# EAGLE design RF_front_end_final_copy_for_doc (EAGLE 5.10)

## Sheet 1 of 9
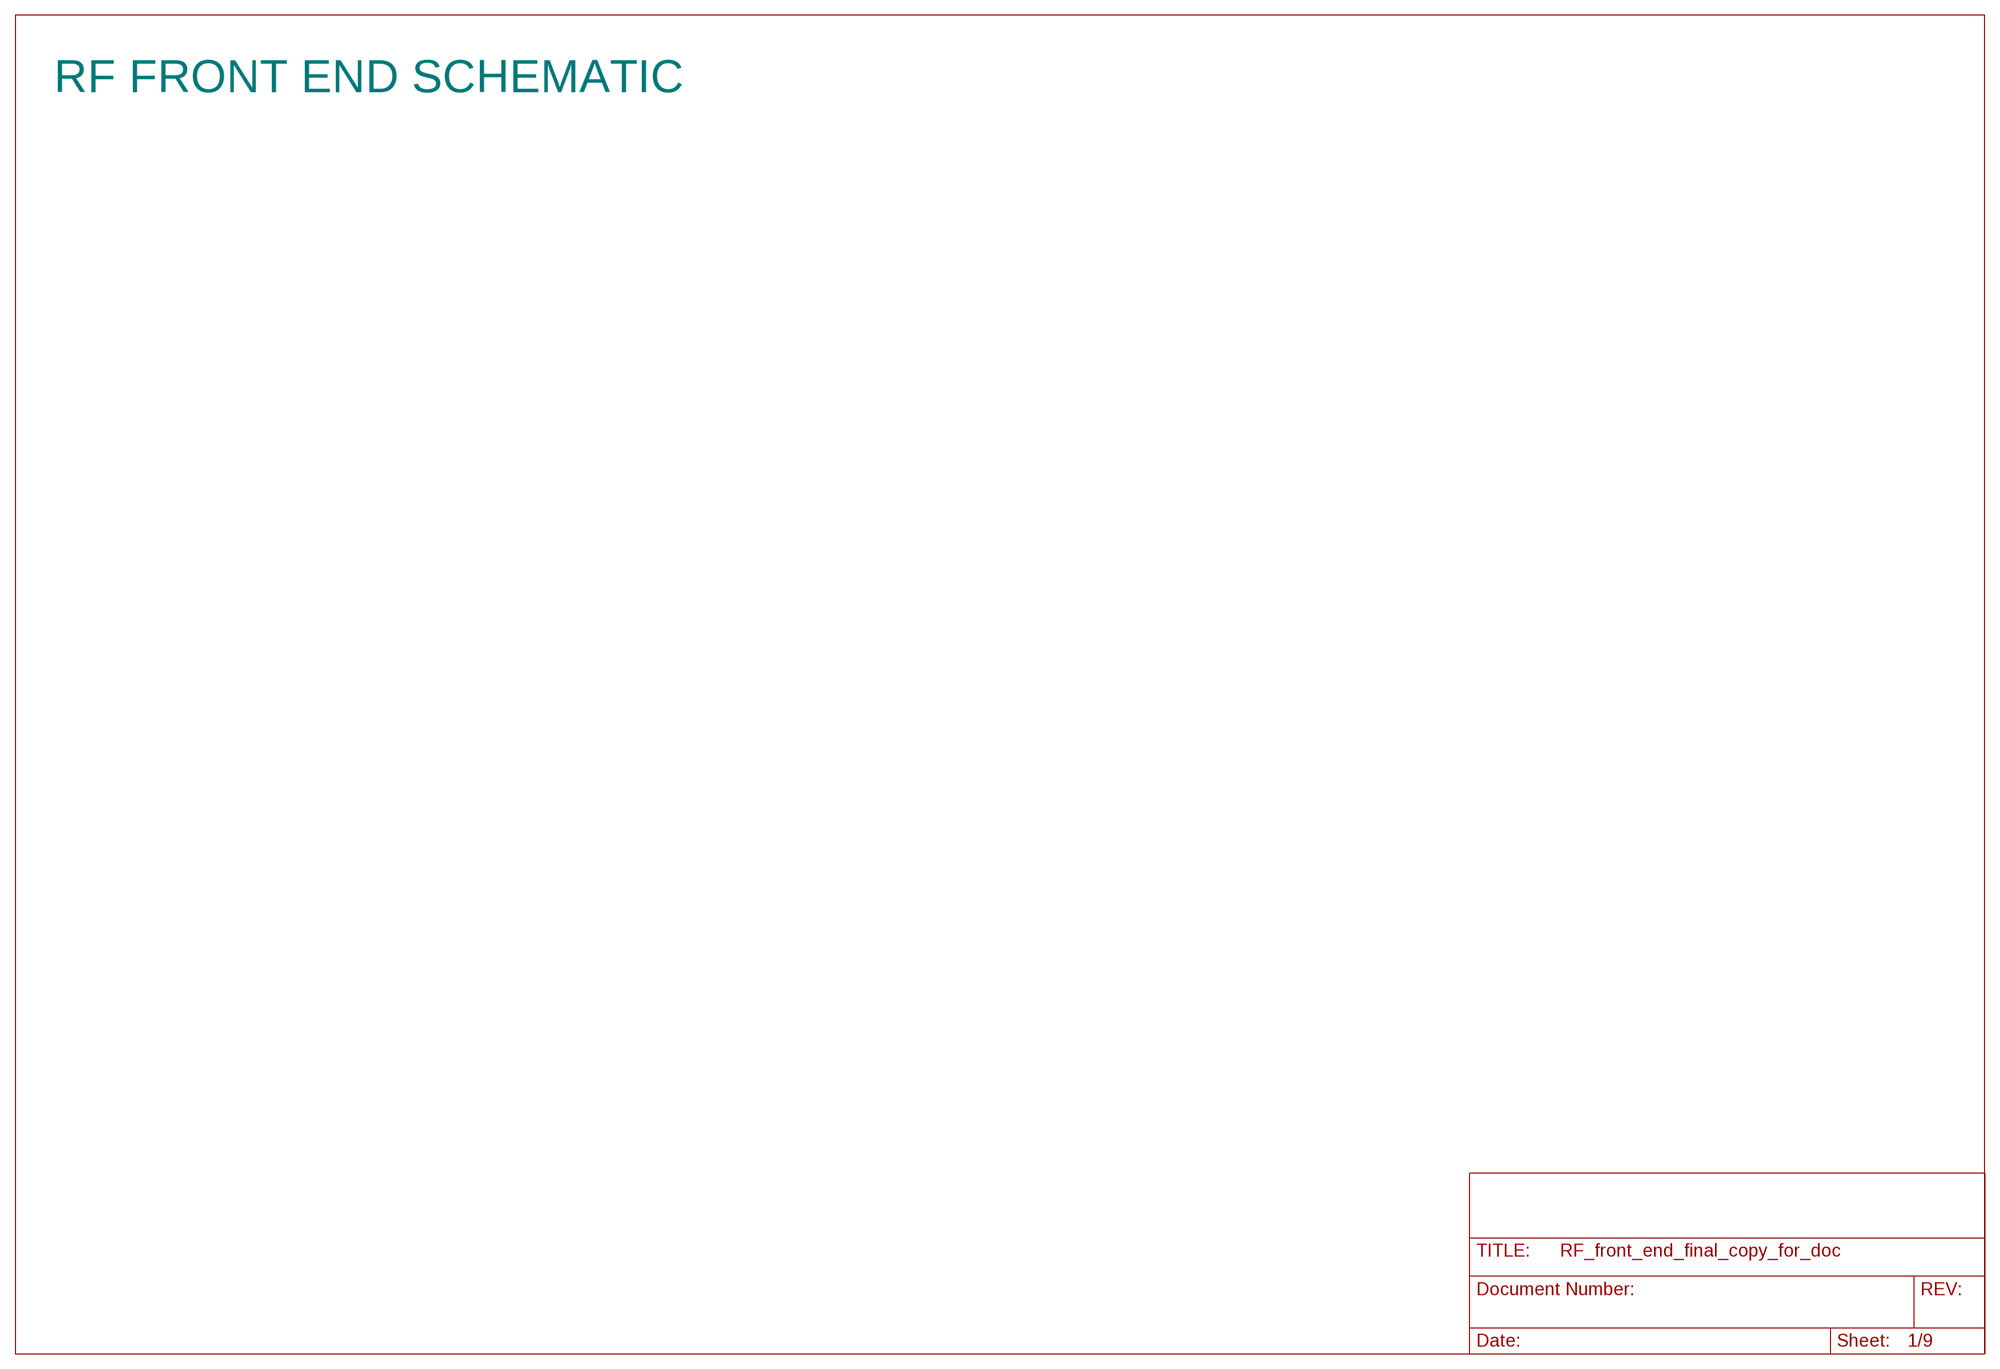
[diagram p0: schematic, sheet 1]

### Notes on the sheet
- RF FRONT END SCHEMATIC

## Sheet 2 of 9
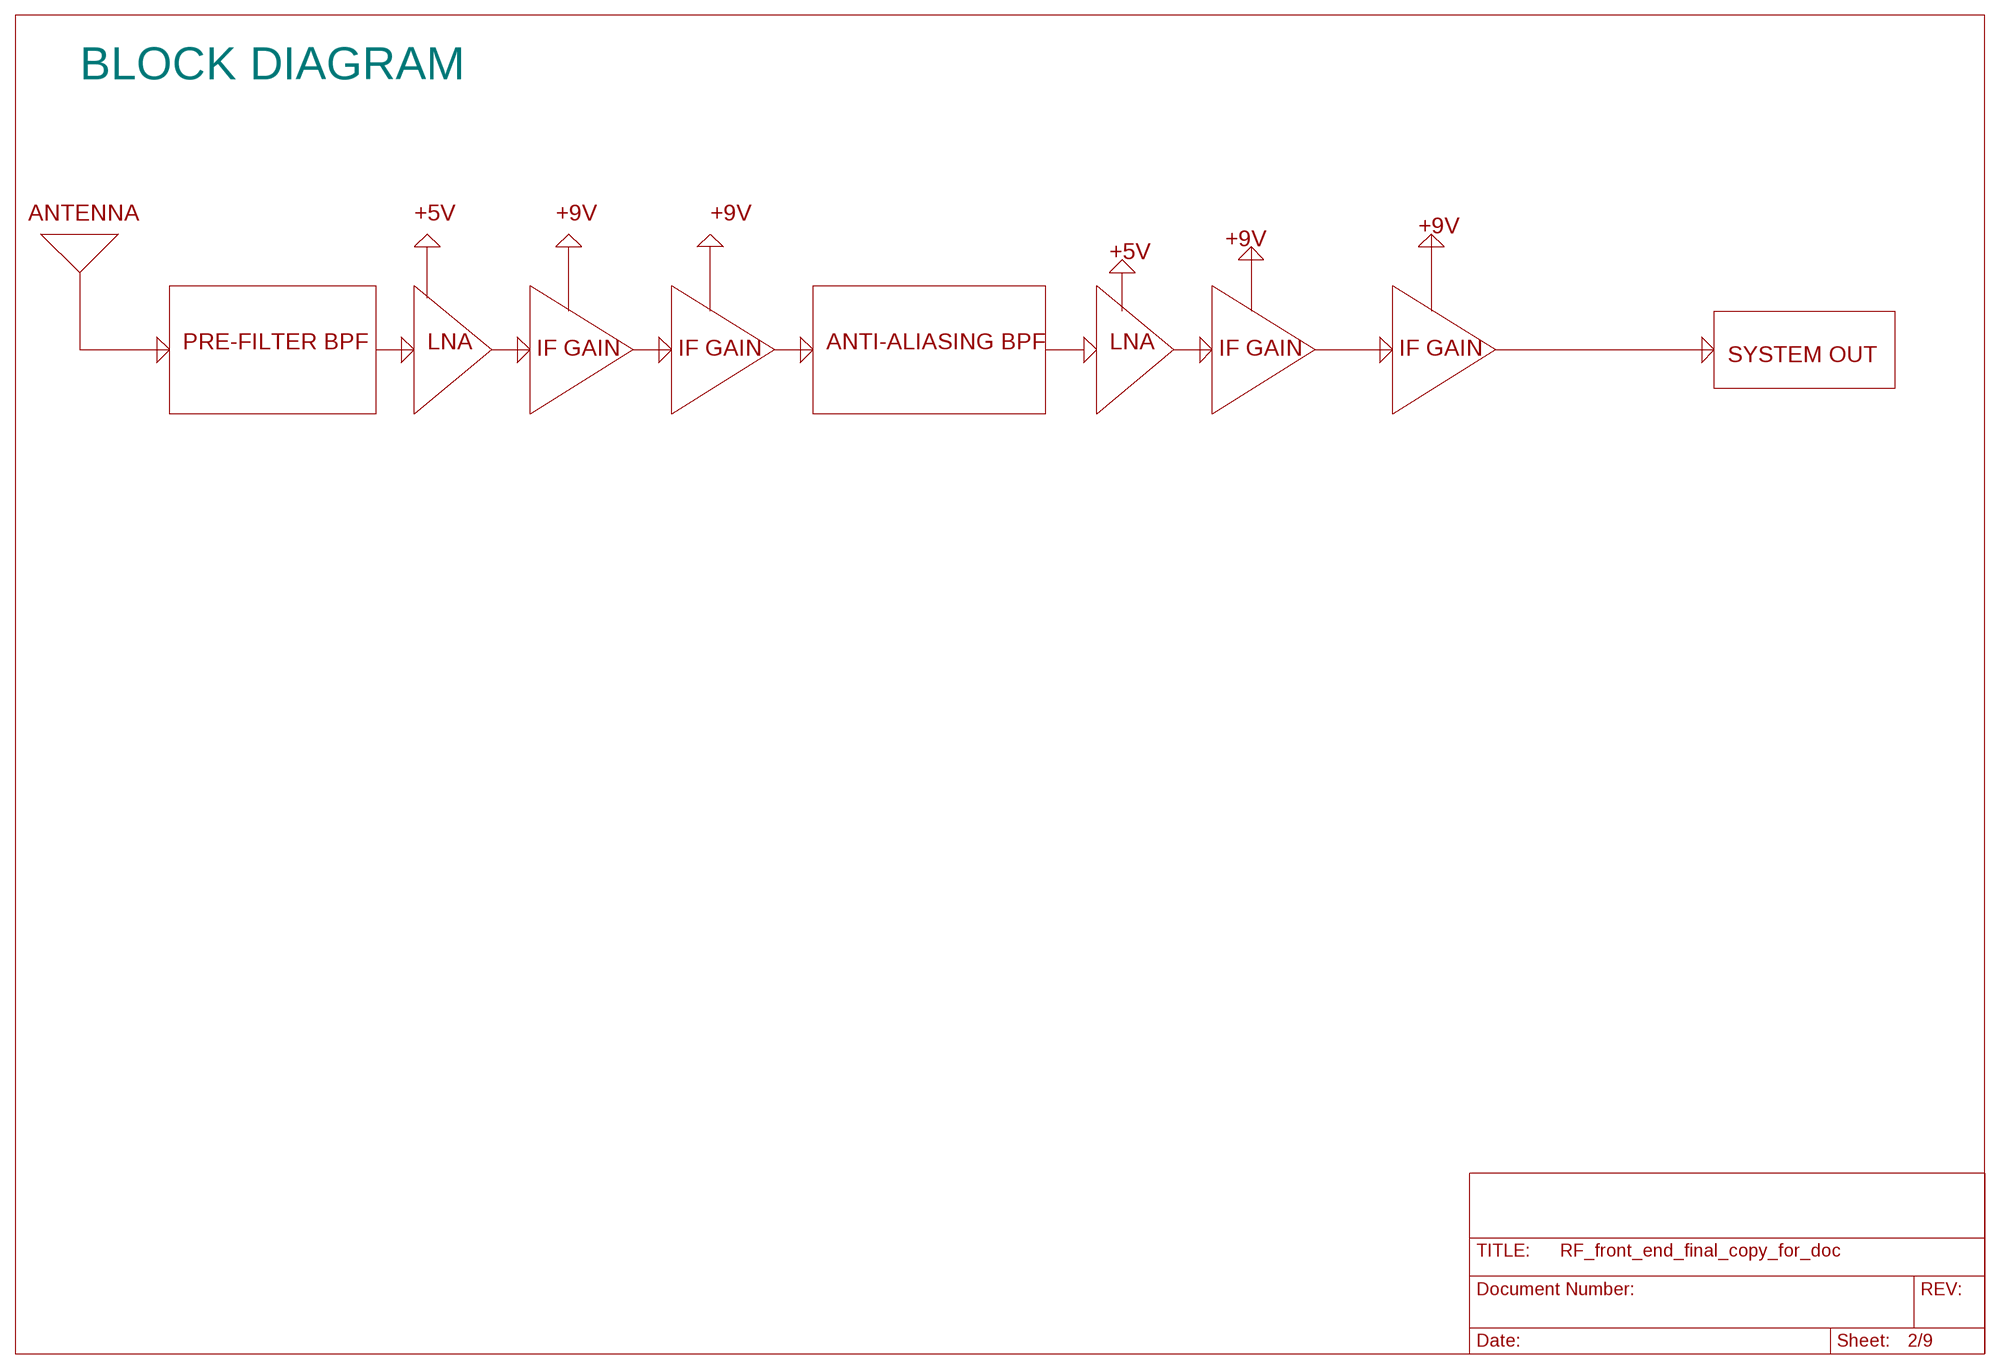
[diagram p1: schematic, sheet 2]

### Notes on the sheet
- BLOCK DIAGRAM
- ANTENNA | +5V | +9V | +9V
- +9V
- +9V
- +5V
- PRE-FILTER BPF | LNA | IF GAIN | IF GAIN | ANTI-ALIASING BPF | LNA | IF GAIN | IF GAIN
- SYSTEM OUT

## Sheet 3 of 9
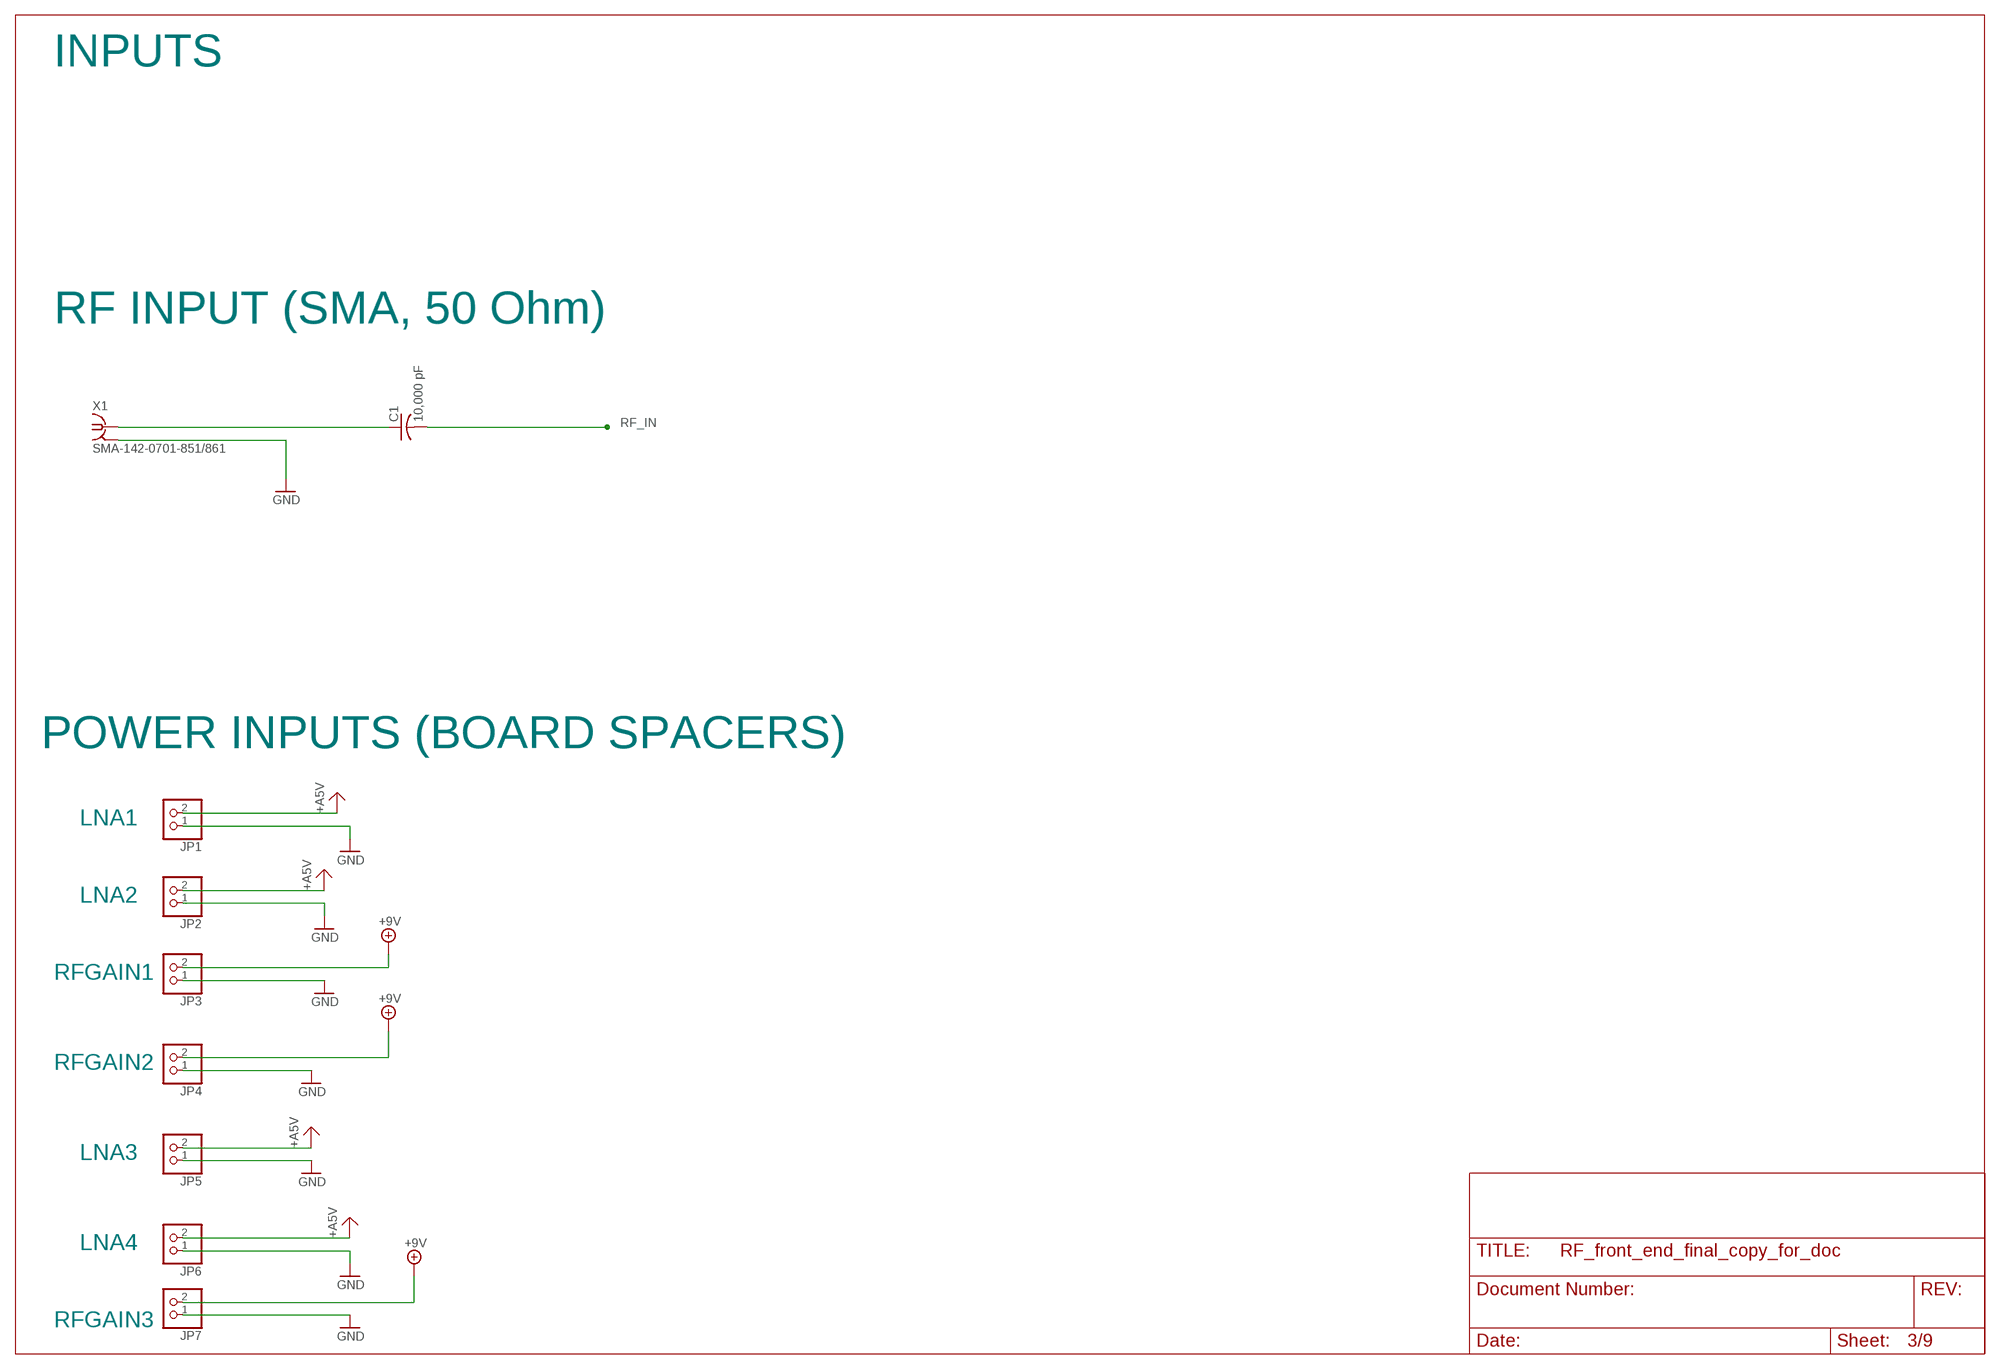
[diagram p2: schematic, sheet 3]

### Parts
C1  10,000 pF  C-USC0603  [C0603]
JP1  PINHD-1X2  [1X02]
JP2  PINHD-1X2  [1X02]
JP3  PINHD-1X2  [1X02]
JP4  PINHD-1X2  [1X02]
JP5  PINHD-1X2  [1X02]
JP6  PINHD-1X2  [1X02]
JP7  PINHD-1X2  [1X02]
X1  SMA-142-0701-851/861  [J502-ND-142-0701-851/861]

### Nets
+9V: JP3.2 JP4.2 JP7.2 ; also sheet 6,8
+A5V: JP1.2 JP2.2 JP5.2 JP6.2 ; also sheet 5,8
GND: JP1.1 JP2.1 JP3.1 JP4.1 JP5.1 JP6.1 JP7.1 X1.G@1(GND) ; also sheet 4,5,6,7,8,9
N$16: C1.1 X1.1
RF_IN: C1.2 ; also sheet 4

### Notes on the sheet
- INPUTS
- RF INPUT (SMA, 50 Ohm)
- POWER INPUTS (BOARD SPACERS)
- LNA1
- LNA2
- RFGAIN1
- RFGAIN2
- LNA3
- LNA4
- RFGAIN3

## Sheet 4 of 9
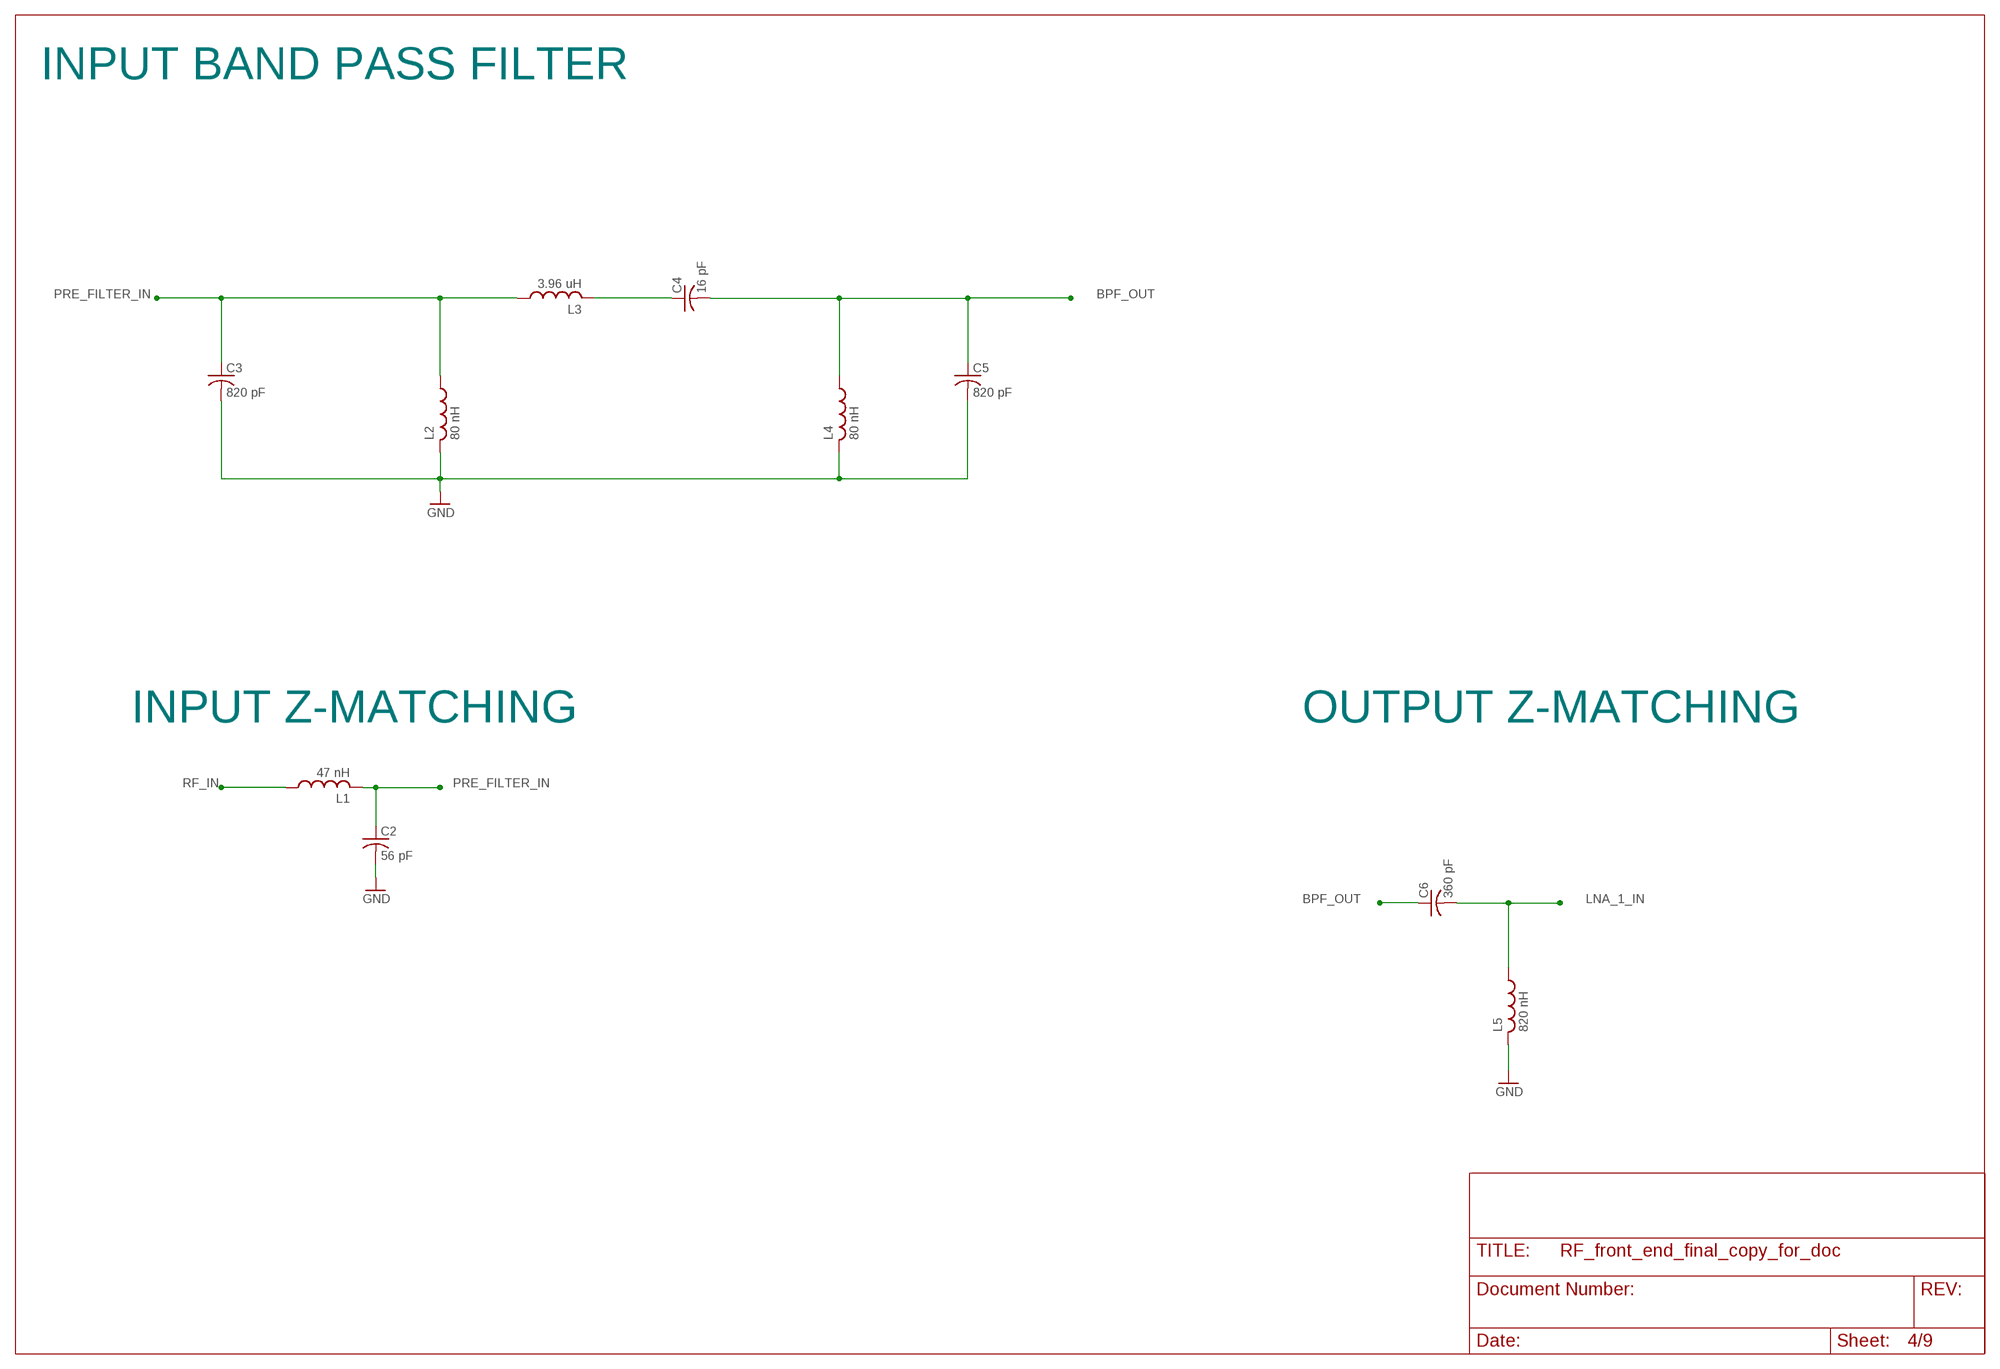
[diagram p3: schematic, sheet 4]

### Parts
C2  56 pF  C-USC0603  [C0603]
C3  820 pF  C-USC0805  [C0805]
C4  16 pF  C-USC0603  [C0603]
C5  820 pF  C-USC0805  [C0805]
C6  360 pF  C-USC0603  [C0603]
L1  47 nH  L-US0603  [R0603]
L2  80 nH  L-US0805  [R0805]
L3  3.96 uH  L-US1812  [C1812]
L4  80 nH  L-US0805  [R0805]
L5  820 nH  L-US0603  [R0603]

### Nets
BPF_OUT: C4.2 C5.1 C6.1 L4.1
GND: C2.2 C3.2 C5.2 L2.2 L4.2 L5.2 ; also sheet 3,5,6,7,8,9
LNA_1_IN: C6.2 L5.1 ; also sheet 5
N$71: C4.1 L3.2
PRE_FILTER_IN: C2.1 C3.1 L1.2 L2.1 L3.1
RF_IN: L1.1 ; also sheet 3

### Notes on the sheet
- INPUT BAND PASS FILTER
- INPUT Z-MATCHING | OUTPUT Z-MATCHING

## Sheet 5 of 9
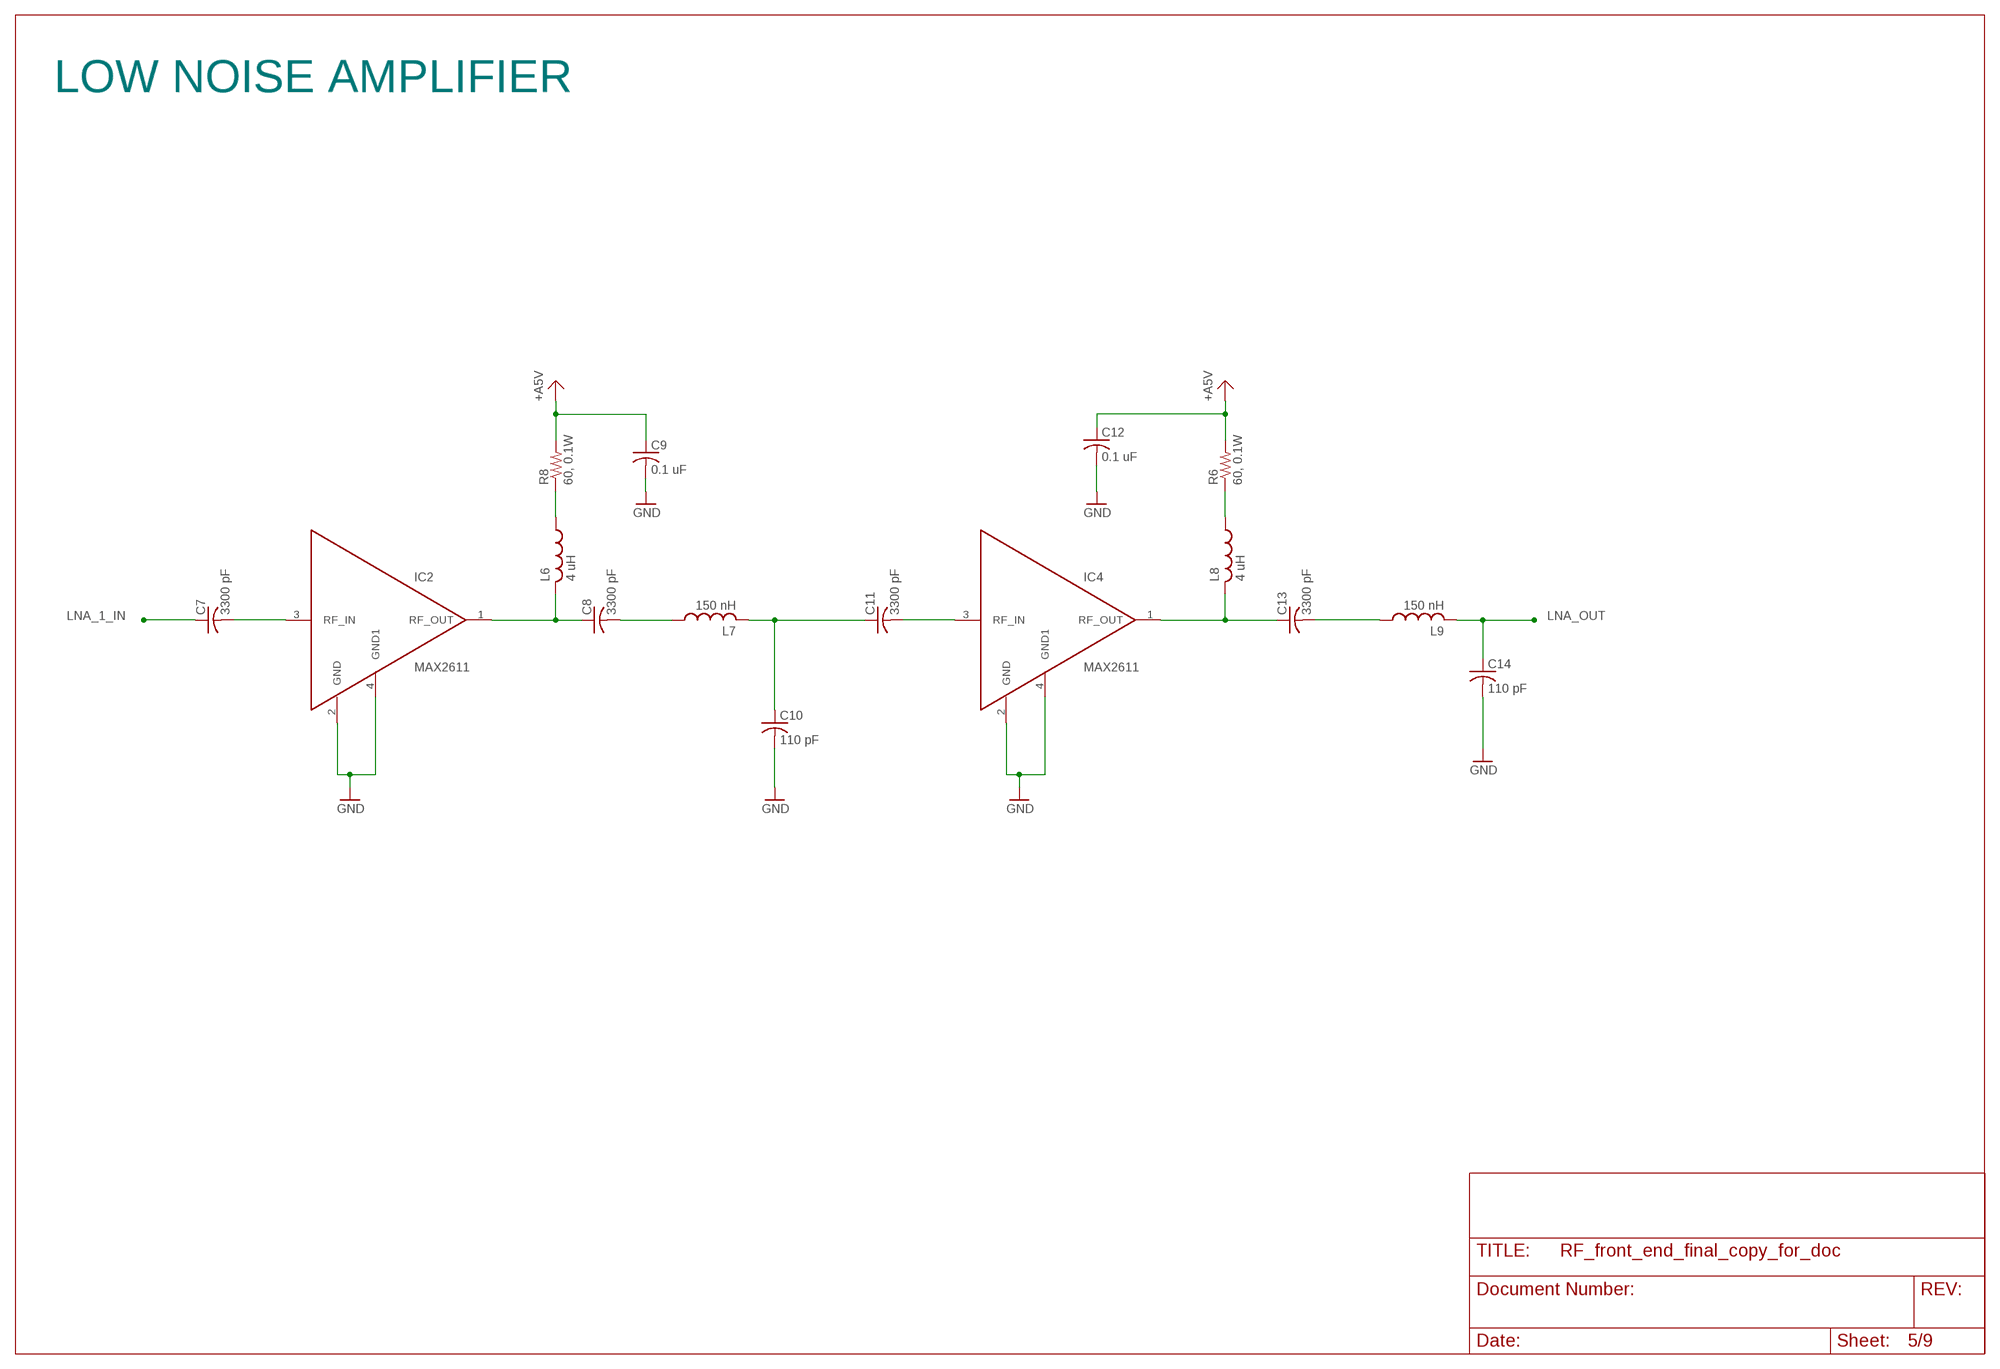
[diagram p4: schematic, sheet 5]

### Parts
C7  3300 pF  C-USC0603  [C0603]
C8  3300 pF  C-USC0603  [C0603]
C9  0.1 uF  C-USC0603  [C0603]
C10  110 pF  C-USC0603  [C0603]
C11  3300 pF  C-USC0603  [C0603]
C12  0.1 uF  C-USC0603  [C0603]
C13  3300 pF  C-USC0603  [C0603]
C14  110 pF  C-USC0603  [C0603]
IC2  MAX2611  [SOT143_MAX2611]
IC4  MAX2611  [SOT143_MAX2611]
L6  4 uH  L-US1008LS-392XJLB  [1008LS-392XJLB]
L7  150 nH  L-US0603  [R0603]
L8  4 uH  L-US1008LS-392XJLB  [1008LS-392XJLB]
L9  150 nH  L-US0603  [R0603]
R6  60, 0.1W  R-US_R0603  [R0603]
R8  60, 0.1W  R-US_R0603  [R0603]

### Nets
+A5V: C9.1 C12.1 R6.2 R8.2 ; also sheet 3,8
GND: C9.2 C10.2 C12.2 C14.2 IC2.2(GND) IC2.4(GND1) IC4.2(GND) IC4.4(GND1) ; also sheet 3,4,6,7,8,9
LNA_1_IN: C7.1 ; also sheet 4
LNA_OUT: C14.1 L9.2 ; also sheet 6
N$9: C11.2 IC4.3(RF_IN)
N$10: C13.1 IC4.1(RF_OUT) L8.P$2
N$11: L8.P$1 R6.1
N$12: C8.2 L7.1
N$22: C10.1 C11.1 L7.2
N$28: C13.2 L9.1
N$33: C8.1 IC2.1(RF_OUT) L6.P$2
N$41: L6.P$1 R8.1
N$67: C7.2 IC2.3(RF_IN)

### Notes on the sheet
- LOW NOISE AMPLIFIER

## Sheet 6 of 9
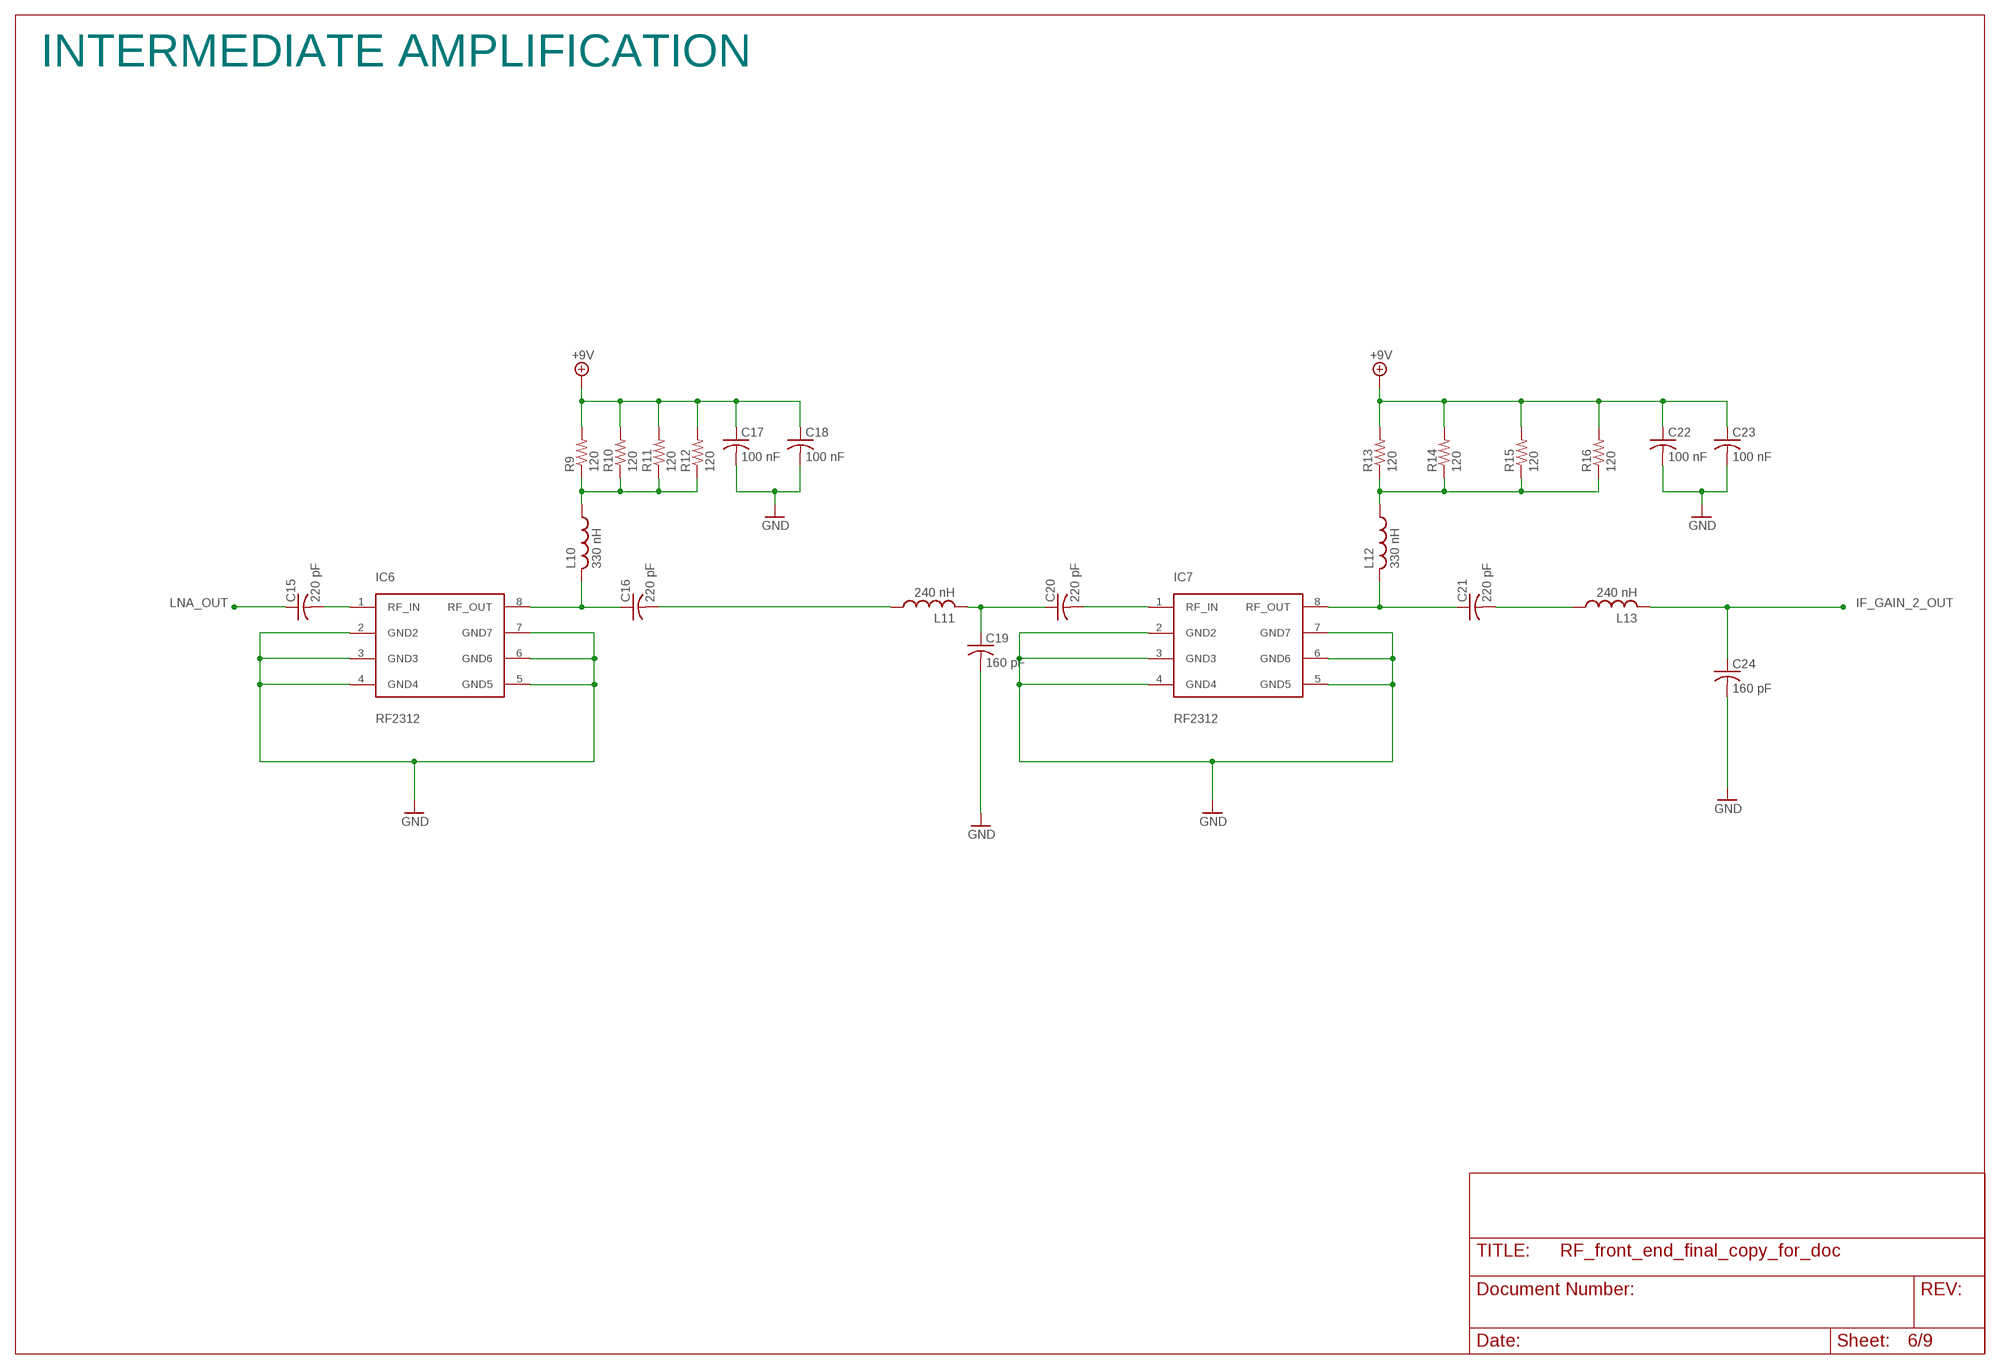
[diagram p5: schematic, sheet 6]

### Parts
C15  220 pF  C-USC0603  [C0603]
C16  220 pF  C-USC0603  [C0603]
C17  100 nF  C-USC0805  [C0805]
C18  100 nF  C-USC0805  [C0805]
C19  160 pF  C-USC0603  [C0603]
C20  220 pF  C-USC0603  [C0603]
C21  220 pF  C-USC0603  [C0603]
C22  100 nF  C-USC0805  [C0805]
C23  100 nF  C-USC0805  [C0805]
C24  160 pF  C-USC0603  [C0603]
IC6  RF2312  [SO08]
IC7  RF2312  [SO08]
L10  330 nH  L-US132-17L  [132-17L]
L11  240 nH  L-US0603  [R0603]
L12  330 nH  L-US132-17L  [132-17L]
L13  240 nH  L-US0603  [R0603]
R9  120  R-US_R0603  [R0603]
R10  120  R-US_R0603  [R0603]
R11  120  R-US_R0603  [R0603]
R12  120  R-US_R0603  [R0603]
R13  120  R-US_R0603  [R0603]
R14  120  R-US_R0603  [R0603]
R15  120  R-US_R0603  [R0603]
R16  120  R-US_R0603  [R0603]

### Nets
+9V: C17.1 C18.1 C22.1 C23.1 R9.2 R10.2 R11.2 R12.2 R13.2 R14.2 R15.2 R16.2 ; also sheet 3,8
GND: C17.2 C18.2 C19.2 C22.2 C23.2 C24.2 IC6.2(GND2) IC6.3(GND3) IC6.4(GND4) IC6.5(GND5) IC6.6(GND6) IC6.7(GND7) IC7.2(GND2) IC7.3(GND3) IC7.4(GND4) IC7.5(GND5) IC7.6(GND6) IC7.7(GND7) ; also sheet 3,4,5,7,8,9
IF_GAIN_2_OUT: C24.1 L13.2 ; also sheet 7
LNA_OUT: C15.1 ; also sheet 5
N$1: C16.2 L11.1
N$17: C21.1 IC7.8(RF_OUT) L12.P$2
N$19: C20.2 IC7.1(RF_IN)
N$20: L12.P$1 R13.1 R14.1 R15.1 R16.1
N$27: C19.1 C20.1 L11.2
N$29: C21.2 L13.1
N$40: C15.2 IC6.1(RF_IN)
N$43: C16.1 IC6.8(RF_OUT) L10.P$2
N$69: L10.P$1 R9.1 R10.1 R11.1 R12.1

### Notes on the sheet
- INTERMEDIATE AMPLIFICATION

## Sheet 7 of 9
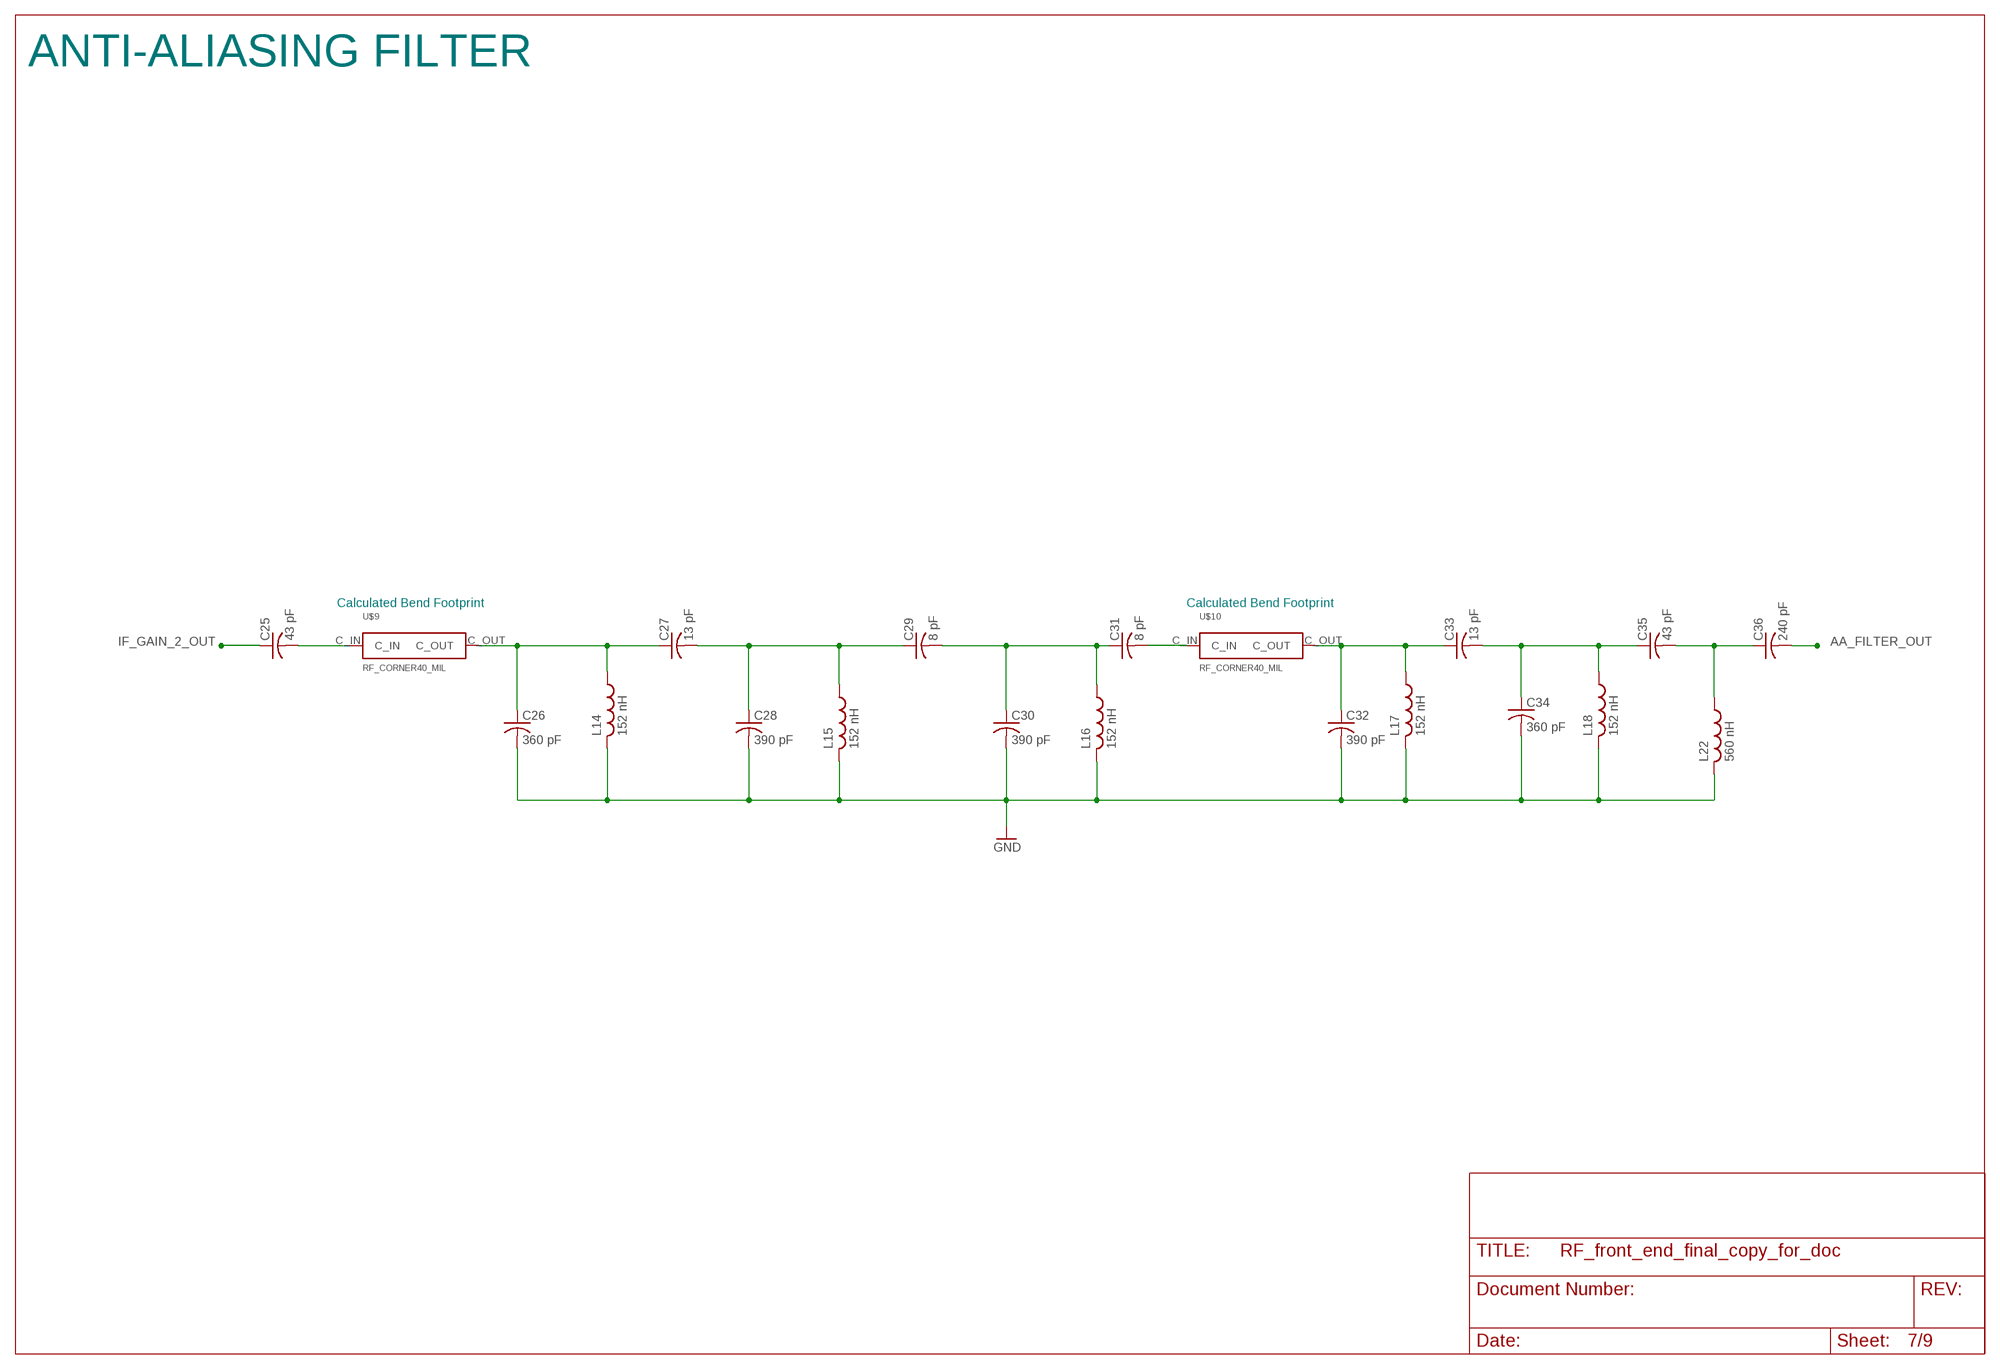
[diagram p6: schematic, sheet 7]

### Parts
C25  43 pF  C-USC0603  [C0603]
C26  360 pF  C-USC0603  [C0603]
C27  13 pF  C-USC0603  [C0603]
C28  390 pF  C-USC1210  [C1210]
C29  8 pF  C-USC0603  [C0603]
C30  390 pF  C-USC1210  [C1210]
C31  8 pF  C-USC0603  [C0603]
C32  390 pF  C-USC1210  [C1210]
C33  13 pF  C-USC0603  [C0603]
C34  360 pF  C-USC0603  [C0603]
C35  43 pF  C-USC0603  [C0603]
C36  240 pF  C-USC0603  [C0603]
L14  152 nH  L-USHA4031  [HA4031]
L15  152 nH  L-USHA4031  [HA4031]
L16  152 nH  L-USHA4031  [HA4031]
L17  152 nH  L-USHA4031  [HA4031]
L18  152 nH  L-USHA4031  [HA4031]
L22  560 nH  L-US0603  [R0603]
U$9  RF_CORNER40_MIL  [RF_CORNER_40_MIL]
U$10  RF_CORNER40_MIL  [RF_CORNER_40_MIL]

### Nets
AA_FILTER_OUT: C36.2 ; also sheet 8
GND: C26.2 C28.2 C30.2 C32.2 C34.2 L14.P$2 L15.P$2 L16.P$2 L17.P$2 L18.P$2 L22.2 ; also sheet 3,4,5,6,8,9
IF_GAIN_2_OUT: C25.1 ; also sheet 6
N$15: C26.1 C27.1 L14.P$1 U$9.C_OUT
N$18: C27.2 C28.1 C29.1 L15.P$1
N$23: C29.2 C30.1 C31.1 L16.P$1
N$24: C32.1 C33.1 L17.P$1 U$10.C_OUT
N$25: C33.2 C34.1 C35.1 L18.P$1
N$26: C25.2 U$9.C_IN
N$30: C35.2 C36.1 L22.1
N$37: C31.2 U$10.C_IN

### Notes on the sheet
- ANTI-ALIASING FILTER
- Calculated Bend Footprint | Calculated Bend Footprint

## Sheet 8 of 9
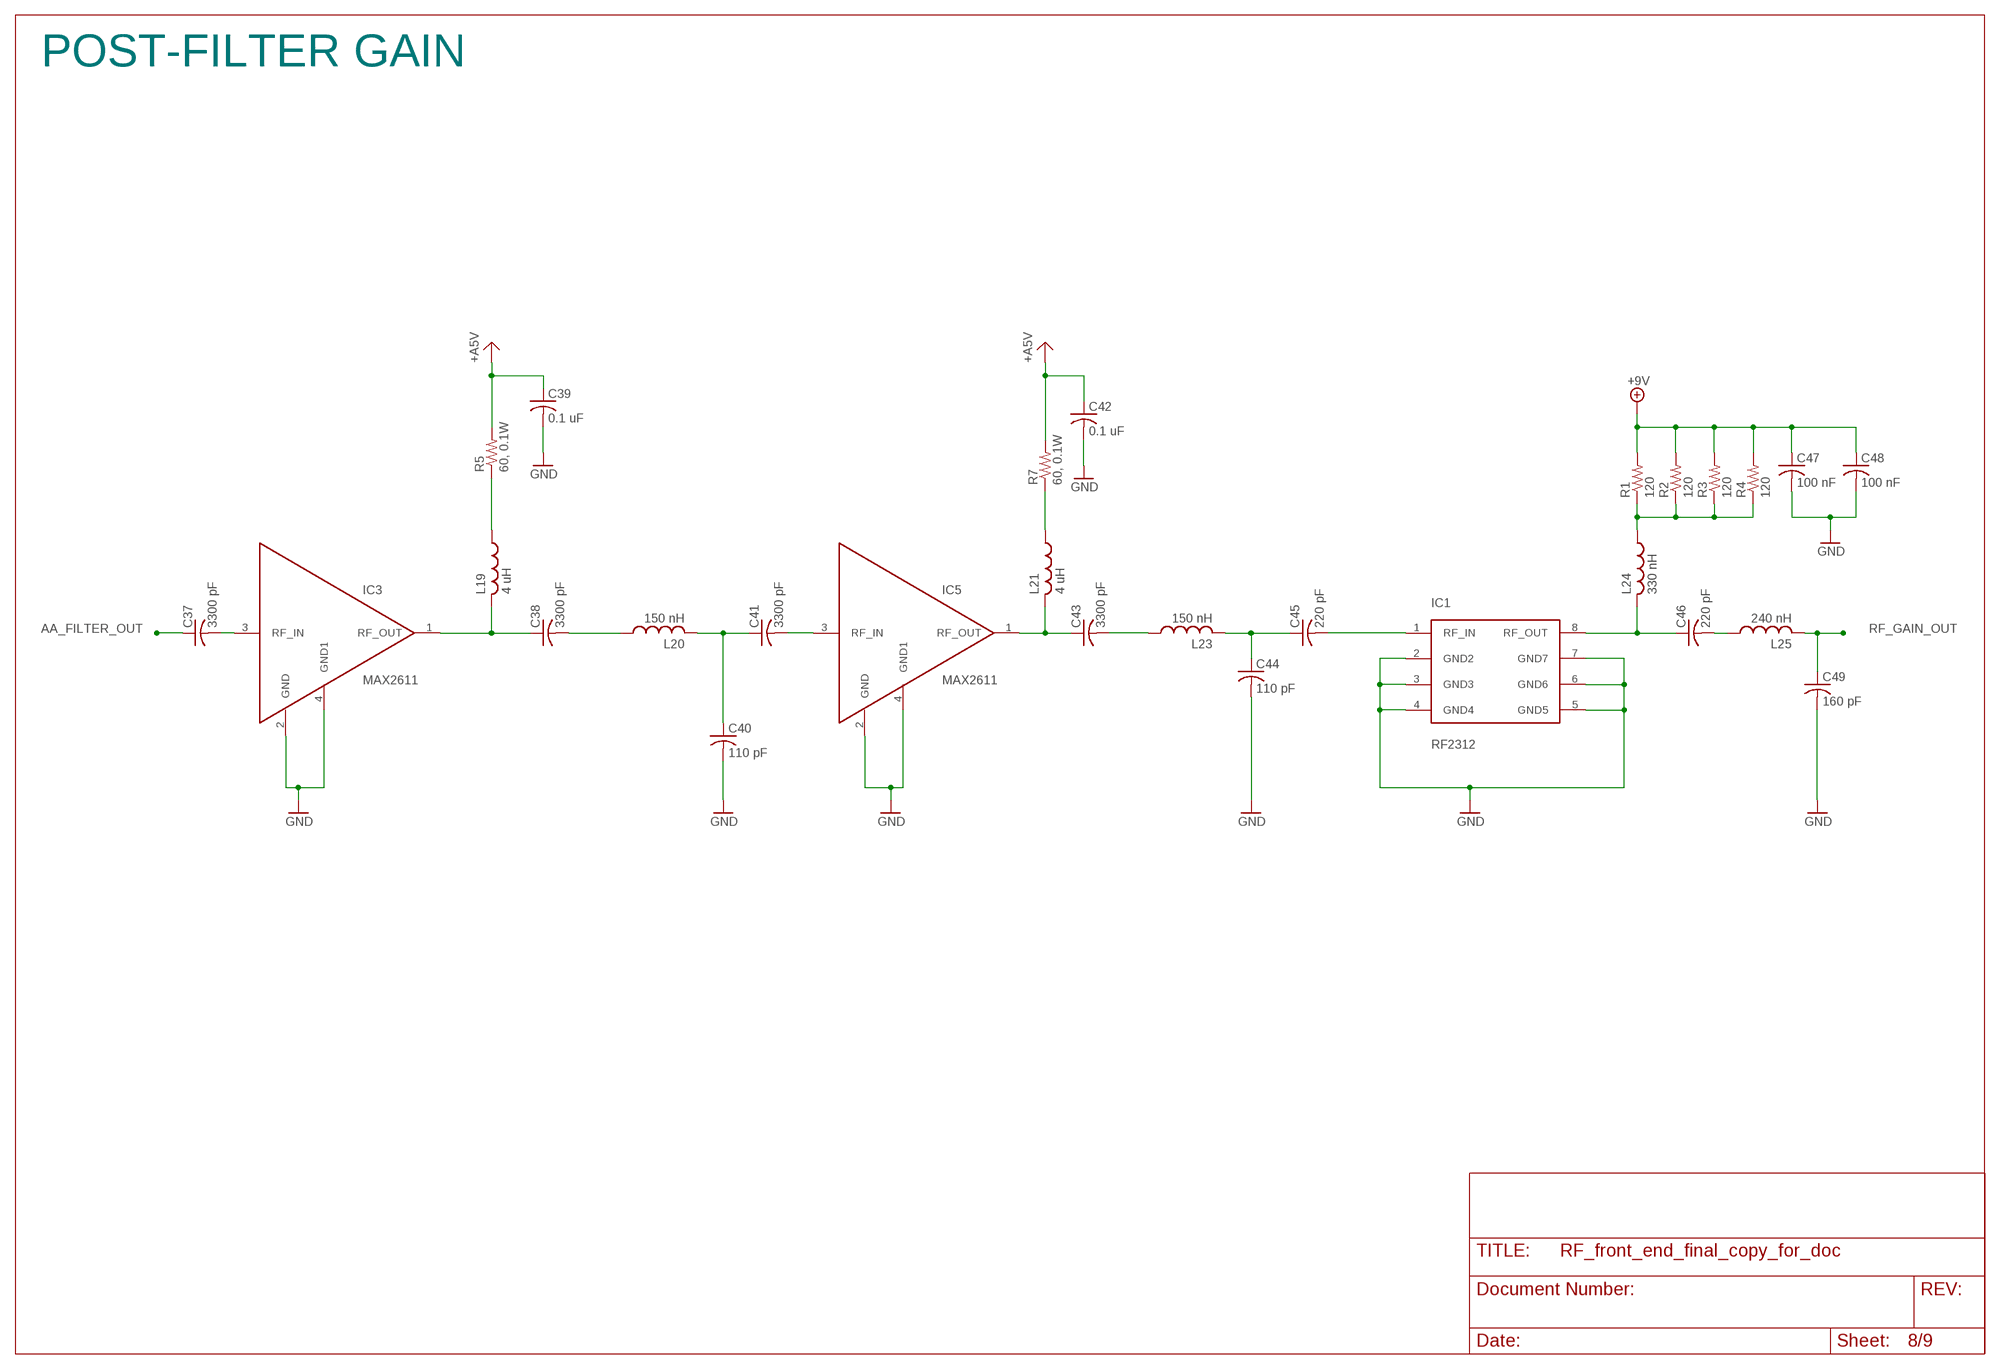
[diagram p7: schematic, sheet 8]

### Parts
C37  3300 pF  C-USC0603  [C0603]
C38  3300 pF  C-USC0603  [C0603]
C39  0.1 uF  C-USC0603  [C0603]
C40  110 pF  C-USC0603  [C0603]
C41  3300 pF  C-USC0603  [C0603]
C42  0.1 uF  C-USC0603  [C0603]
C43  3300 pF  C-USC0603  [C0603]
C44  110 pF  C-USC0603  [C0603]
C45  220 pF  C-USC0603  [C0603]
C46  220 pF  C-USC0603  [C0603]
C47  100 nF  C-USC0805  [C0805]
C48  100 nF  C-USC0805  [C0805]
C49  160 pF  C-USC0603  [C0603]
IC1  RF2312  [SO08]
IC3  MAX2611  [SOT143_MAX2611]
IC5  MAX2611  [SOT143_MAX2611]
L19  4 uH  L-US1008LS-392XJLB  [1008LS-392XJLB]
L20  150 nH  L-US0603  [R0603]
L21  4 uH  L-US1008LS-392XJLB  [1008LS-392XJLB]
L23  150 nH  L-US0603  [R0603]
L24  330 nH  L-US132-17L  [132-17L]
L25  240 nH  L-US0603  [R0603]
R1  120  R-US_R0603  [R0603]
R2  120  R-US_R0603  [R0603]
R3  120  R-US_R0603  [R0603]
R4  120  R-US_R0603  [R0603]
R5  60, 0.1W  R-US_R0603  [R0603]
R7  60, 0.1W  R-US_R0603  [R0603]

### Nets
+9V: C47.1 C48.1 R1.2 R2.2 R3.2 R4.2 ; also sheet 3,6
+A5V: C39.1 C42.1 R5.2 R7.2 ; also sheet 3,5
AA_FILTER_OUT: C37.1 ; also sheet 7
GND: C39.2 C40.2 C42.2 C44.2 C47.2 C48.2 C49.2 IC1.2(GND2) IC1.3(GND3) IC1.4(GND4) IC1.5(GND5) IC1.6(GND6) IC1.7(GND7) IC3.2(GND) IC3.4(GND1) IC5.2(GND) IC5.4(GND1) ; also sheet 3,4,5,6,7,9
N$2: C46.1 IC1.8(RF_OUT) L24.P$2
N$3: C45.2 IC1.1(RF_IN)
N$4: L24.P$1 R1.1 R2.1 R3.1 R4.1
N$5: C37.2 IC3.3(RF_IN)
N$6: C38.1 IC3.1(RF_OUT) L19.P$2
N$7: L19.P$1 R5.1
N$8: C41.2 IC5.3(RF_IN)
N$14: C43.1 IC5.1(RF_OUT) L21.P$2
N$21: L21.P$1 R7.1
N$31: C38.2 L20.1
N$32: C40.1 C41.1 L20.2
N$34: C43.2 L23.1
N$35: C44.1 C45.1 L23.2
N$36: C46.2 L25.1
RF_GAIN_OUT: C49.1 L25.2 ; also sheet 9

### Notes on the sheet
- POST-FILTER GAIN

## Sheet 9 of 9
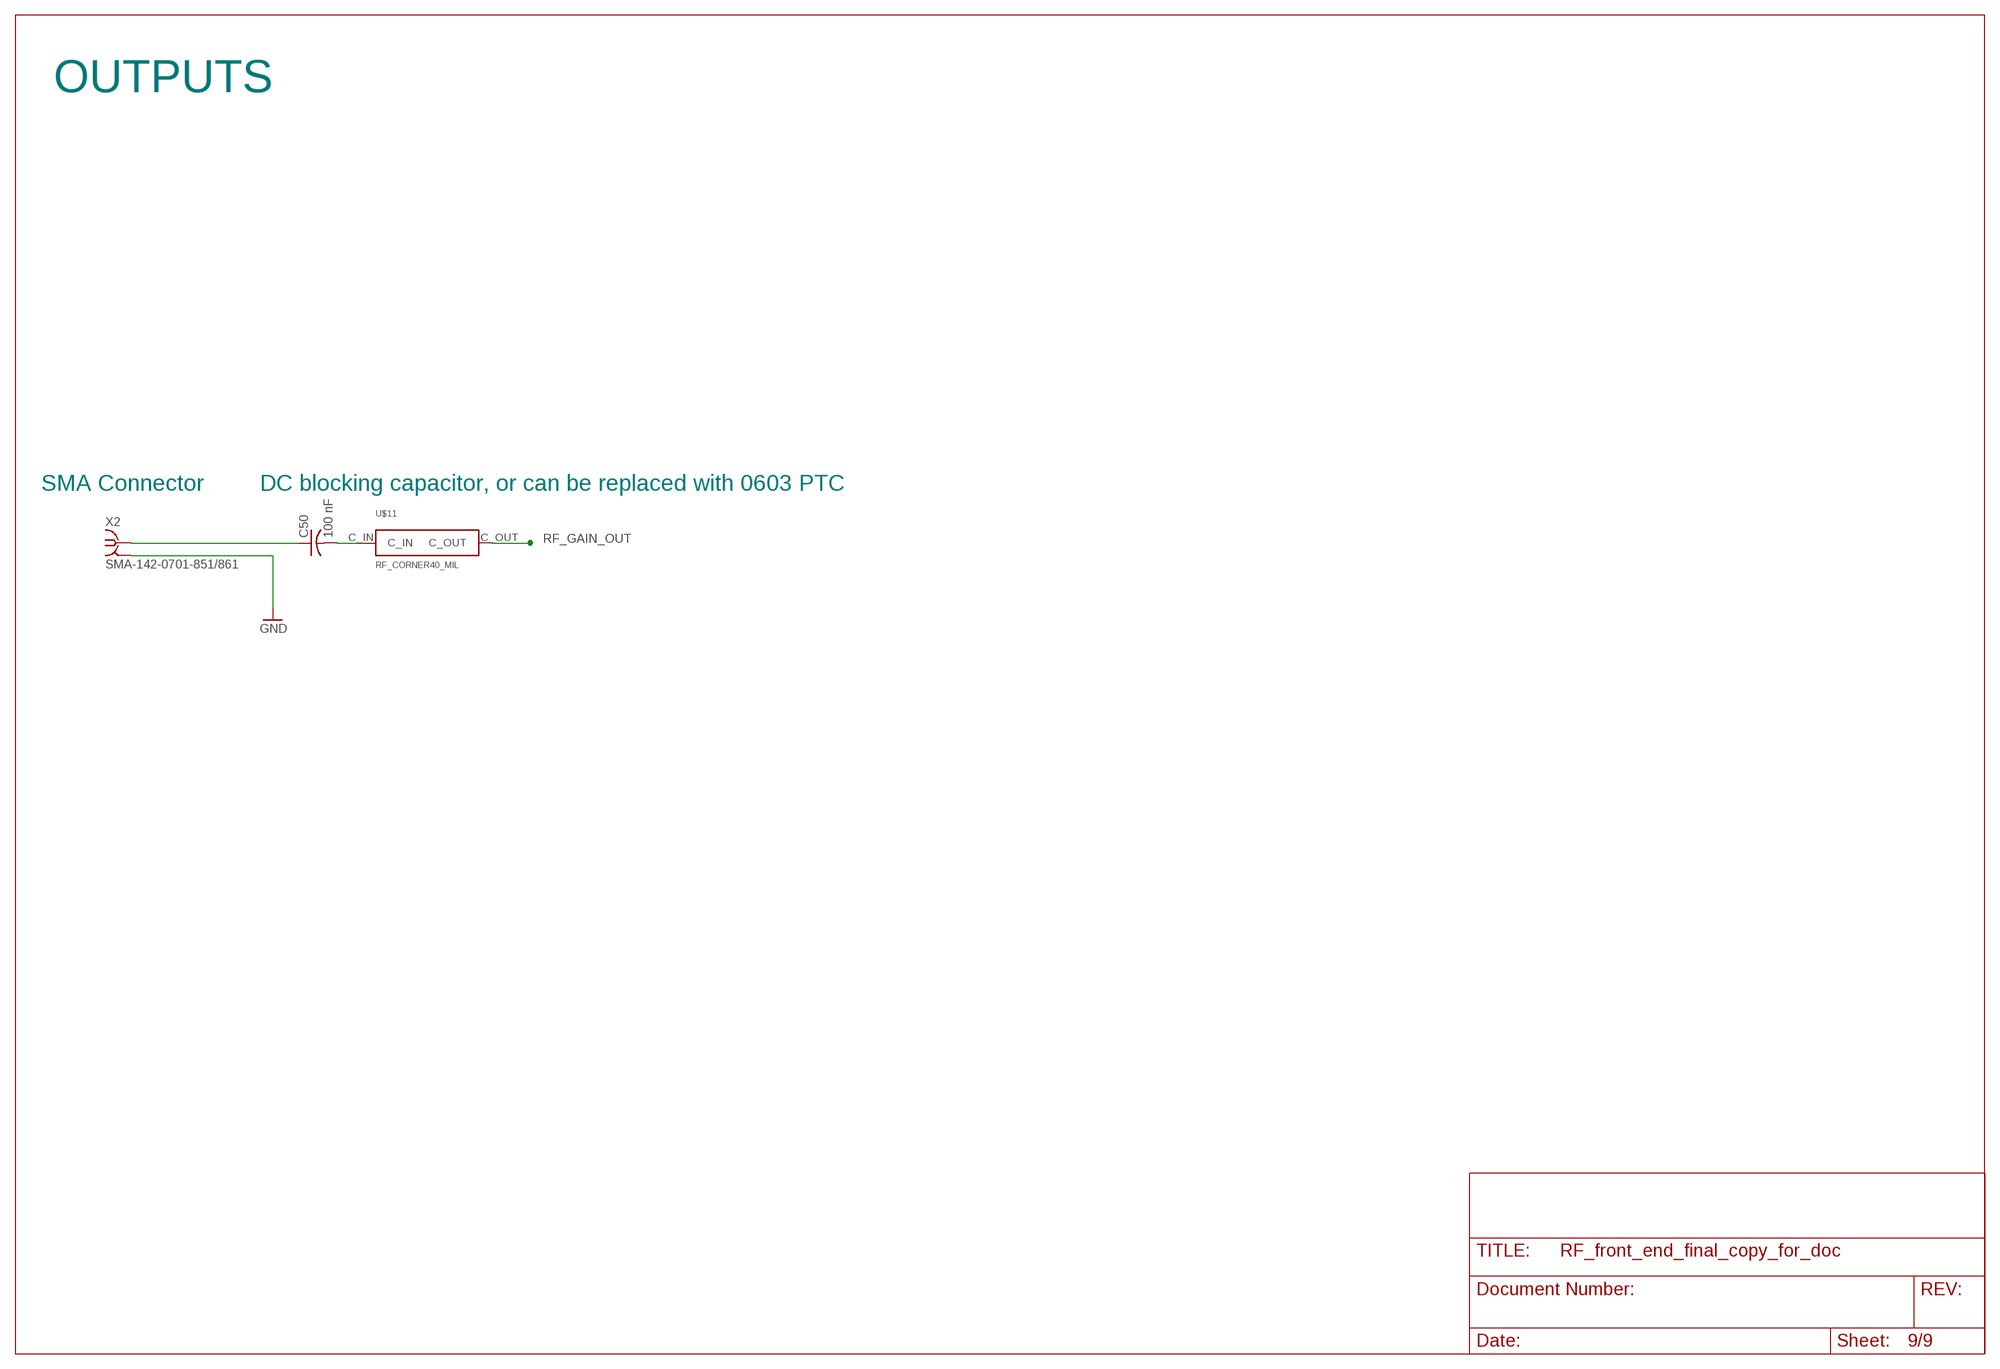
[diagram p8: schematic, sheet 9]

### Parts
C50  100 nF  C-USC0603  [C0603]
U$11  RF_CORNER40_MIL  [RF_CORNER_40_MIL]
X2  SMA-142-0701-851/861  [J502-ND-142-0701-851/861]

### Nets
GND: X2.G@1(GND) ; also sheet 3,4,5,6,7,8
N$13: C50.1 X2.1
N$38: C50.2 U$11.C_IN
RF_GAIN_OUT: U$11.C_OUT ; also sheet 8

### Notes on the sheet
- OUTPUTS
- SMA Connector | DC blocking capacitor, or can be replaced with 0603 PTC

## Power pins joined to a net without a drawn wire
GND: X1.G@2(GND) X1.G@3(GND) X1.G@4(GND) X2.G@2(GND) X2.G@3(GND) X2.G@4(GND)

## Library data of the parts
C1-C18 C20-C23 C25-C50 = rcl:C-US: CAPACITOR, American symbol
C19 C24 = resistor:C-US: CAPACITOR, American symbol
IC1 IC6 IC7 = senior_project_lib:RF2312
IC2-IC5 = senior_project_lib:MAX2611
JP1-JP7 = pinhead:PINHD-1X2: PIN HEADER
L1-L25 = senior_project_lib:L-US: INDUCTOR, American symbol
R1-R16 = rcl:R-US_: RESISTOR, American symbol
U$9-U$11 = senior_project_lib:RF_CORNER
X1 X2 = con-coax:SMA-: SMA 50 Ohm End Launch Jack Receptacle - Round Contact Johnson Components Source: www.johnsoncomponents.com .. J502-ND.pdf; MF: JOHNSON COMPONENTS; MPN: 142-0701-851; OC_FARNELL: 1019325; OC_NEWARK: 99F6798

## Board
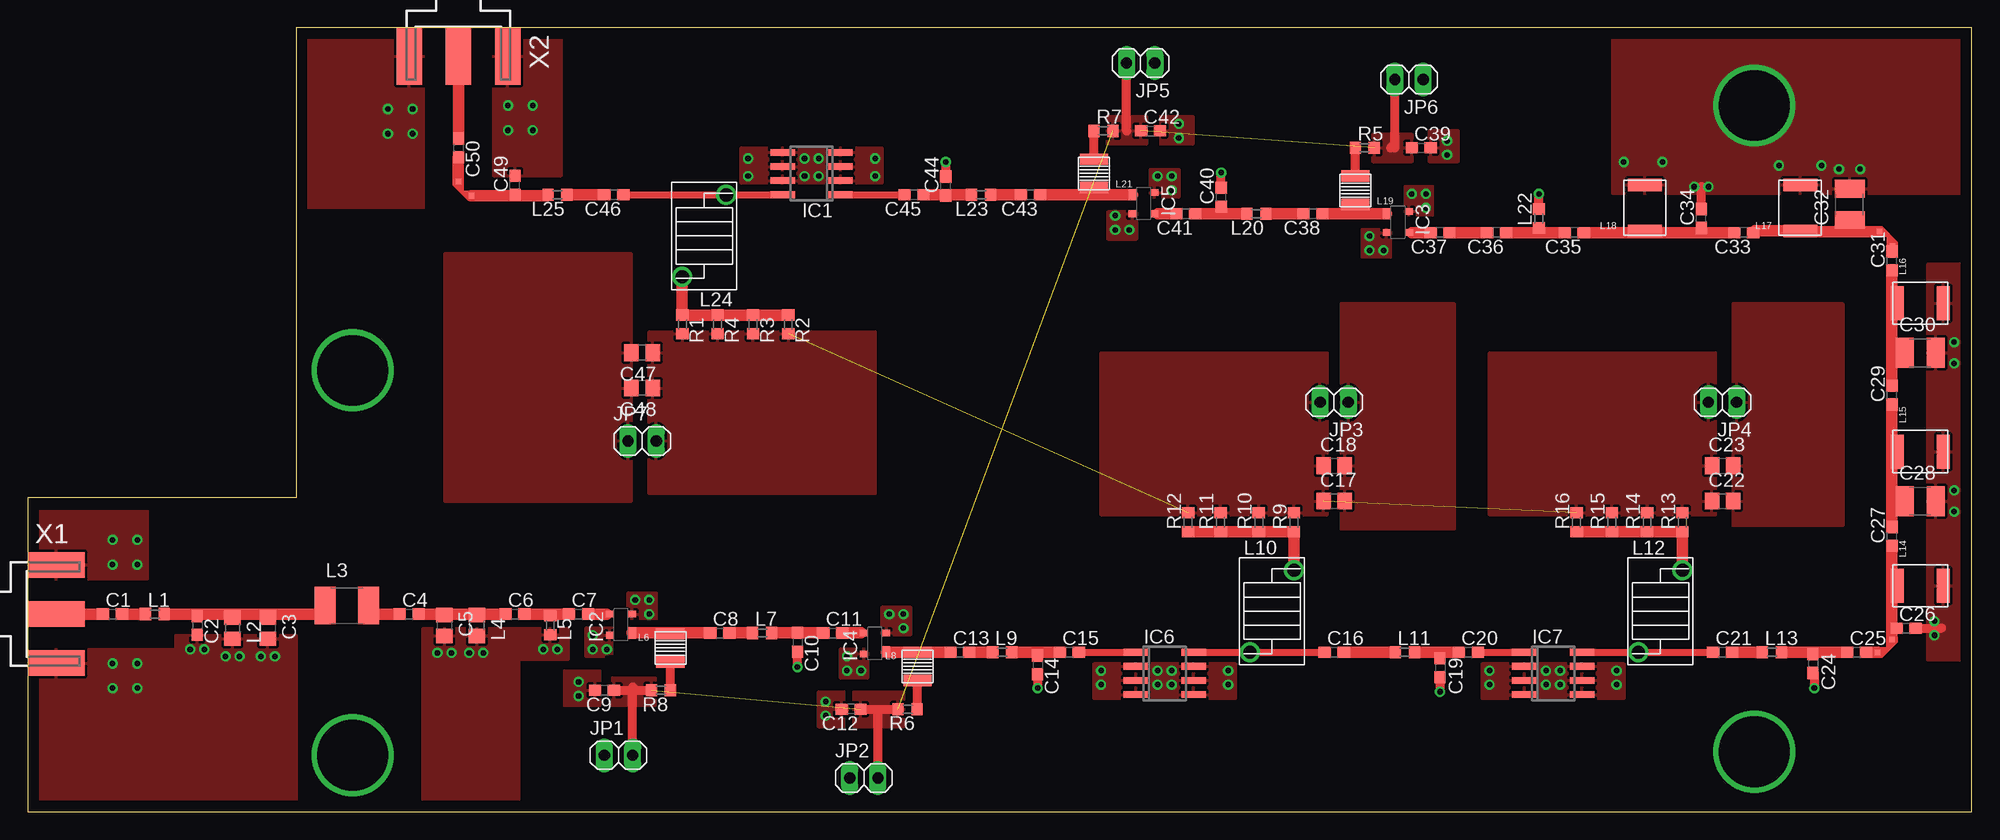
[diagram p9: board, top side]
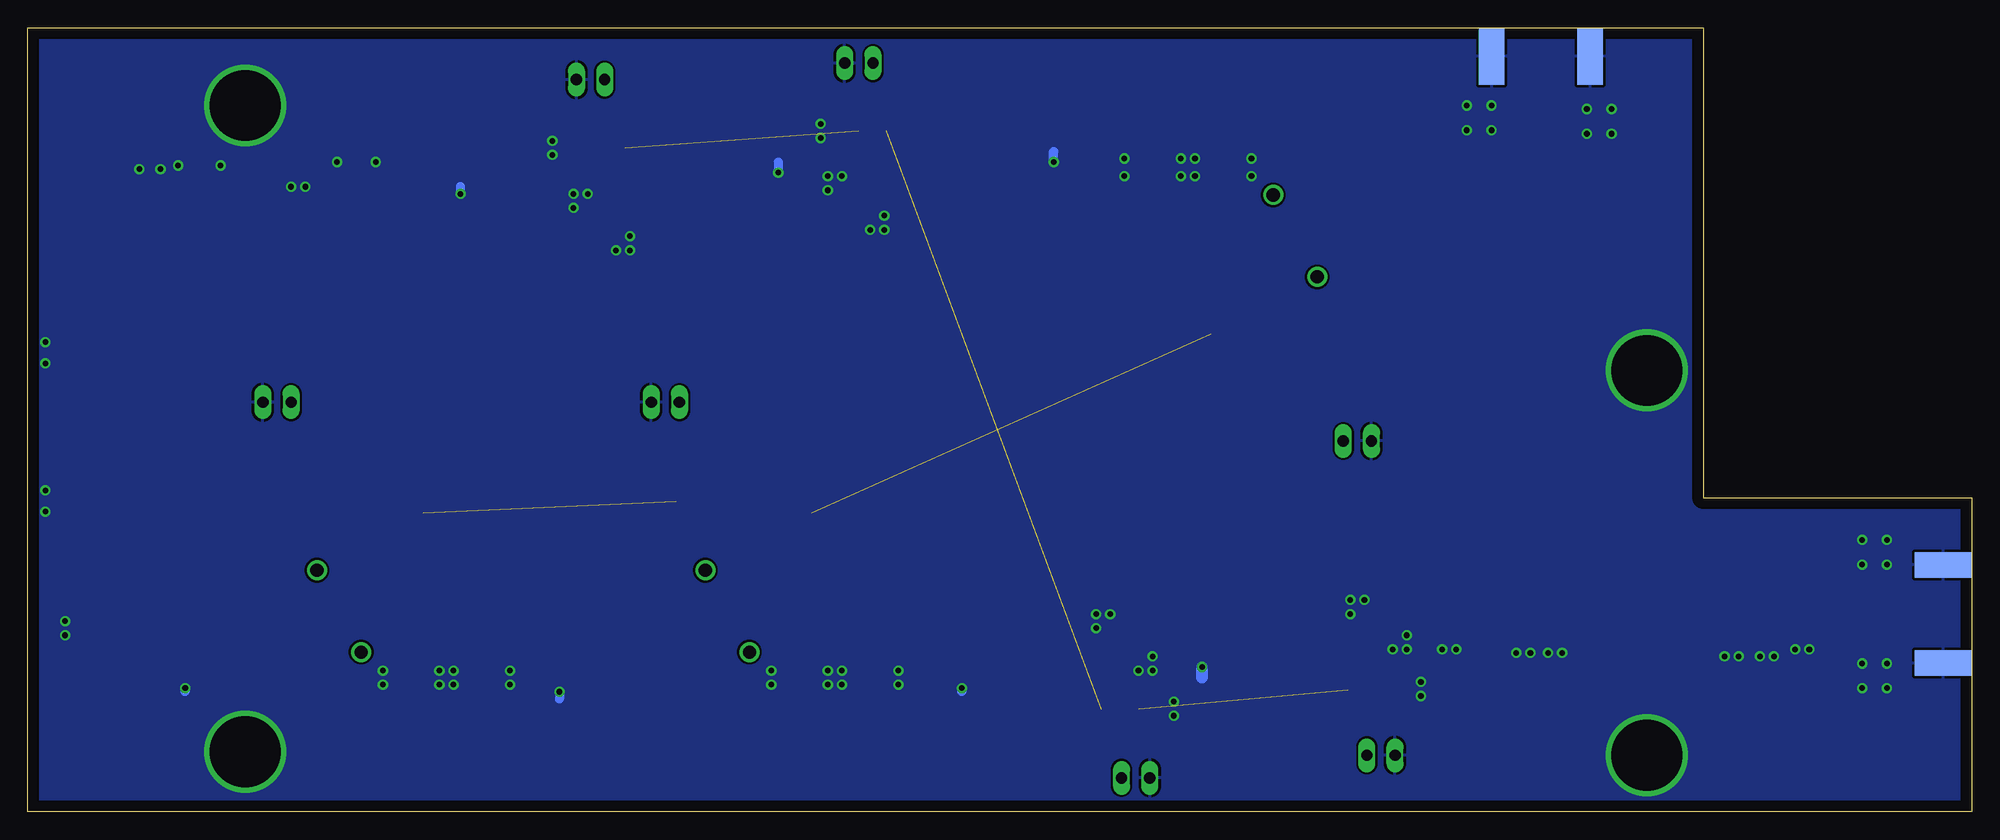
[diagram p10: board, bottom side, seen from below]

Size 174.81 x 70.48 mm. Coordinates in mm from the lower left corner, seen from the top.
Outline: 0,0 174.81,0 174.81,70.48 24.13,70.48 24.13,28.26 0,28.26 0,0
Copper layers (1*16): Top 0.035mm / dielectric 1.5mm / Bottom 0.035mm
Design rules "default": minimum track width 10mil, minimum drill 24mil, track to track 8mil, track to pad 8mil, pad to pad 8mil, via to via 8mil, smd to smd 8mil, copper to edge 40mil, drill to drill 8mil, minimum pad ring 10mil, minimum via ring 8mil, stop-mask expansion 4mil, vias tented up to drill 0mil, thermal gap 10mil
tKeepout: 4 lines
tRestrict: 85 lines

### Footprints (pad centres in the part's own frame; a part is rotated, then mirrored left to right if it is on the bottom)
C0603 = smd 1.1 x 1: 1 -0.85,0; 2 0.85,0
C0805 = smd 1.3 x 1.5: 1 -0.95,0; 2 0.95,0
C1210 = smd 1.6 x 2.7: 1 -1.4,0; 2 1.4,0
SO08 = smd 0.6 x 2.2: 1 -1.905,-2.6; 2 -0.635,-2.6; 3 0.635,-2.6; 4 1.905,-2.6; 5 1.905,2.6; 6 0.635,2.6; 7 -0.635,2.6; 8 -1.905,2.6
SOT143_MAX2611 = smd 1 x 0.7: 1 -0.75,-1 | smd 0.6 x 0.7: 2 0.95,-1; 3 0.95,1; 4 -0.95,1
1X02 = drill 1.016 long: 1 -1.27,0; 2 1.27,0
R0603 = smd 1 x 1.1: 1 -0.85,0; 2 0.85,0
R0805 = smd 1.3 x 1.5: 1 -0.95,0; 2 0.95,0
C1812 = smd 1.9 x 3.4: 1 -1.95,0; 2 1.95,0
1008LS-392XJLB = smd 2.54 x 1.016: P$1 0,1.27; P$2 0,-1.27
132-17L = drill 1.2 round: P$1 1.981,3.683; P$2 -1.981,-3.683
HA4031 = smd 3.048 x 1.143: P$1 0,2.07; P$2 0,-2.07
RF_CORNER_40_MIL = smd 0.508 x 0.508: C_IN 0.229,0.508; C_OUT 1.524,1.676
J502-ND-142-0701-851/861 = smd 5.08 x 2.286: 1 2.565,0; G@1 2.565,4.42; G@2 2.565,-4.42 | smd 5.08 x 2.286 bottom: G@3 2.565,4.42; G@4 2.565,-4.42

### Placement (x,y rotation side)
C1  7.62,17.78 0 top
C2  15.24,16.76 270 top
C3  21.59,16.51 270 top
C4  34.29,17.78 0 top
C5  37.47,16.76 270 top
C6  43.81,17.78 0 top
C7  49.53,17.78 0 top
C8  62.23,16.08 0 top
C9  51.85,10.92 180 top
C10  69.22,15.24 270 top
C11  72.39,16.08 0 top
C12  74.04,9.23 180 top
C13  83.82,14.35 0 top
C14  90.81,13.21 270 top
C15  93.66,14.35 0 top
C16  117.47,14.35 0 top
C17  117.47,27.94 0 top
C18  117.47,31.11 0 top
C19  127,12.95 270 top
C20  129.54,14.35 0 top
C21  152.4,14.35 0 top
C22  152.4,27.94 0 top
C23  152.4,31.11 0 top
C24  160.53,13.34 270 top
C25  164.47,14.35 0 top
C26  168.91,16.51 0 top
C27  167.64,24.77 90 top
C28  170.18,27.94 0 top
C29  167.64,37.47 90 top
C30  170.18,41.27 0 top
C31  167.64,49.53 90 top
C32  163.83,54.61 90 top
C33  154.31,52.07 180 top
C34  150.5,53.34 90 top
C35  139.06,52.07 180 top
C36  132.08,52.07 180 top
C37  127,52.07 180 top
C38  115.57,53.77 180 top
C39  125.31,59.69 0 top
C40  107.31,55.24 90 top
C41  104.14,53.77 180 top
C42  100.97,61.21 0 top
C43  90.17,55.47 180 top
C44  82.55,56.26 90 top
C45  79.69,55.47 180 top
C46  52.7,55.47 180 top
C47  55.24,41.27 180 top
C48  55.24,38.1 180 top
C49  43.81,56.32 90 top
C50  38.73,59.69 270 top
IC1  70.48,57.38 90 top
IC2  53.34,16.83 90 top
IC3  123.19,53.02 270 top
IC4  76.2,15.14 90 top
IC5  100.33,54.72 270 top
IC6  102.23,12.45 270 top
IC7  137.16,12.45 270 top
JP1  53.12,5.08 0 top
JP2  75.18,3.05 0 top
JP3  117.47,36.83 180 top
JP4  152.4,36.83 180 top
JP5  100.08,67.31 180 top
JP6  124.21,65.83 180 top
JP7  55.24,33.34 0 top
L1  11.43,17.78 0 top
L2  18.41,16.51 270 top
L3  28.7,18.54 0 top
L4  40.39,16.76 270 top
L5  46.99,16.76 270 top
L6  57.78,14.73 180 top
L7  66.04,16.08 0 top
L8  80.01,13.08 180 top
L9  87.63,14.35 0 top
L10  111.89,18.03 0 top
L11  123.83,14.35 0 top
L12  146.81,18.03 0 top
L13  156.84,14.35 0 top
L14  170.18,20.32 90 top
L15  170.18,32.38 90 top
L16  170.18,45.72 90 top
L17  159.38,54.29 180 top
L18  145.41,54.29 180 top
L19  119.38,55.88 0 top
L20  110.49,53.77 180 top
L21  95.89,57.4 0 top
L22  135.89,53.34 90 top
L23  85.72,55.47 180 top
L24  60.83,51.78 180 top
L25  47.62,55.47 180 top
R1  58.86,43.81 270 top
R2  68.39,43.81 270 top
R3  65.21,43.81 270 top
R4  62.04,43.81 270 top
R5  120.23,59.69 0 top
R6  79.12,9.23 180 top
R7  96.74,61.21 0 top
R8  56.93,10.92 180 top
R9  113.87,26.04 90 top
R10  110.69,26.04 90 top
R11  107.26,26.04 90 top
R12  104.34,26.04 90 top
R13  148.79,26.04 90 top
R14  145.62,26.04 90 top
R15  142.44,26.04 90 top
R16  139.27,26.04 90 top
U$9  166.12,13.82 0 top
U$10  168.19,50.64 90 top
U$11  38.2,56.91 270 top
X1  0,17.78 0 top
X2  38.73,70.48 270 top

### Tracks (layer width: path | path; a pad name or v marks a point on that pad's centre or on a via)
+9V  (2 unrouted)
  pour Top: 96.52,41.27 116.84,41.27 116.84,26.67 96.52,26.67
  pour Top: 131.44,41.27 151.76,41.27 151.76,26.67 131.44,26.67
  pour Top: 55.88,43.18 76.2,43.18 76.2,28.57 55.88,28.57
+A5V  (3 unrouted)
  Top 0.813: JP1.2 54.39,11.21 | C9.1 R8.2 | JP2.2 76.45,9.14 | C12.1 R6.2 | 122.56,59.69 122.94,60.07 | 122.94,59.69 JP6.2 | 98.81,61.21 JP5.2
  pour Top: 52.58,12.06 56.39,12.06 56.39,9.53 52.58,9.53
  pour Top: 74.3,10.79 78.74,10.79 78.74,7.62 74.3,7.62
  pour Top: 120.97,60.96 124.46,60.96 124.46,58.42 120.97,58.42
  pour Top: 97.08,62.55 100.58,62.55 100.58,60.01 97.08,60.01
AA_FILTER_OUT
  Top 1.016: C37.1 C36.2
BPF_OUT
  Top 1.016: 37.47,17.78 C4.2 | C5.1 37.47,17.78 | 37.47,17.78 40.39,17.78 | 40.39,17.78 C6.1 | 40.39,17.78 L4.1
GND  (via drill 0.5, 6.35)
  Top 0.813: v69.22,13.02 C10.2 | C14.2 v90.81,11.11 | C19.2 v127,10.79 | L22.2 v135.89,55.56 | C44.2 v82.55,58.42 | C40.2 v107.31,57.47 | C24.2 160.66,12.48 v160.66,11.11 | C26.2 172.09,16.51 | C34.2 150.5,56.2
  Bottom 0.813: v90.81,11.11 90.81,10.79 | v127,10.79 127,10.16 | v135.89,55.56 135.89,56.2 | v82.55,58.42 82.55,59.37 | v107.31,57.47 107.31,58.42 | v160.66,11.11 160.66,10.79
  Bottom 1.016: 69.22,12.06 v69.22,13.02
  other vias: 29.21,39.69 29.21,5.08 155.26,5.4 155.26,63.5 52.07,14.61 50.8,14.61 50.8,15.88 55.88,17.78 55.88,19.05 54.61,19.05 97.79,53.59 102.87,55.88 102.87,57.15 101.6,57.15 97.79,52.32 99.06,52.32 71.75,9.91 71.75,8.64 49.53,11.68 49.53,10.41 78.74,17.78 78.74,16.51 77.47,17.78 73.66,13.97 73.66,12.7 74.93,12.7 125.73,54.29 125.73,55.56 124.46,55.56 120.65,51.75 120.65,50.48 121.92,50.48 101.6,12.7 102.87,12.7 101.6,11.43 102.87,11.43 136.53,12.7 137.79,12.7 136.53,11.43 137.79,11.43 69.85,58.74 71.12,58.74 69.85,57.15 71.12,57.15 96.52,12.7 96.52,11.43 107.95,12.7 107.95,11.43 131.44,12.7 131.44,11.43 142.88,12.7 142.88,11.43 64.77,57.15 64.77,58.74 76.2,57.15 76.2,58.74 103.5,61.85 103.5,60.58 127.64,60.33 127.64,59.05 9.84,24.45 9.84,22.23 7.62,22.23 7.62,24.45 7.62,13.34 9.84,13.34 9.84,11.11 7.62,11.11 14.61,14.61 17.78,13.97 20.95,13.97 36.83,14.29 39.69,14.29 40.96,14.29 38.1,14.29 47.62,14.61 46.35,14.61 15.88,14.61 19.05,13.97 22.23,13.97 171.45,15.88 171.45,17.14 173.23,26.99 173.23,28.89 173.23,40.32 173.23,42.23 162.88,57.78 164.78,57.78 157.48,58.1 161.29,58.1 149.86,56.2 151.13,56.2 147,58.42 143.51,58.42 34.61,63.18 32.38,63.18 32.38,60.96 34.61,60.96 43.18,63.5 43.18,61.28 45.4,61.28 45.4,63.5
  pour Bottom: 0.64,0 -0.64,70.48 174.62,70.48 175.26,0
  pour Top: 52.7,16.51 50.16,16.51 50.16,13.97 52.7,13.97
  pour Top: 48.26,12.7 51.44,12.7 51.44,9.53 48.26,9.53
  pour Top: 53.98,17.78 53.98,19.68 56.52,19.68 56.52,17.14 53.98,17.14
  pour Top: 76.83,15.88 76.83,18.41 79.38,18.41 79.38,15.88
  pour Top: 75.56,14.61 73.03,14.61 73.03,12.06 75.56,12.06
  pour Top: 71.12,10.79 73.66,10.79 73.66,7.62 71.12,7.62
  pour Top: 95.89,13.34 108.58,13.34 108.58,10.16 95.89,10.16
  pour Top: 130.81,13.34 143.51,13.34 143.51,10.16 130.81,10.16
  pour Top: 64.14,59.69 76.83,59.69 76.83,56.52 64.14,56.52
  pour Top: 97.16,53.98 99.69,53.98 99.69,51.44 97.16,51.44
  pour Top: 100.97,55.88 100.97,57.78 103.5,57.78 103.5,55.24 100.97,55.24
  pour Top: 101.6,60.01 101.6,62.55 104.78,62.55 104.78,60.01
  pour Top: 123.83,53.66 126.36,53.66 126.36,56.2 123.83,56.2
  pour Top: 120.02,52.39 122.56,52.39 122.56,49.85 120.02,49.85
  pour Top: 126.05,58.42 126.05,61.28 128.59,61.28 128.59,58.42
  pour Top: 0.64,20.95 10.79,20.95 10.79,26.99 0,26.99 0,20.95
  pour Top: 0,14.61 13.34,14.61 13.34,15.88 24.13,15.88 24.13,0.32 0,0.32
  pour Top: 35.56,16.51 48.58,16.51 48.58,13.65 44.13,13.65 44.13,0 35.56,0
  pour Top: 54.29,27.94 54.29,50.16 37.47,50.16 37.47,27.94
  pour Top: 21.27,70.48 35.56,70.48 35.56,54.29 21.27,54.29
  pour Top: 41.91,70.48 47.94,70.48 47.94,57.15 41.91,57.15
  pour Top: 170.81,48.9 170.81,26.04 170.81,17.78 170.81,13.65 174.62,13.65 174.94,13.65 174.94,49.21 170.81,49.21
  pour Top: 153.35,26.99 153.35,45.72 163.19,45.72 163.19,25.72 153.35,25.72
  pour Top: 118.11,25.4 118.11,45.72 128.27,45.72 128.27,25.4
  pour Top: 142.56,55.56 142.56,70.48 174.94,70.48 174.94,55.56
IF_GAIN_2_OUT
  Top 1.016: L13.2 160.66,14.35 | 160.66,14.35 C25.1 | 160.66,14.35 C24.1
LNA_1_IN
  Top 1.016: 46.99,17.78 C7.1 | 46.99,17.78 C6.2 | L5.1 46.99,17.78
LNA_OUT
  Top 1.016: L9.2 90.81,14.35 | 90.81,14.35 C15.1 | 90.81,14.35 C14.1
N$1
  Top 1.016: C16.2 L11.1
N$2
  Top 0.61: IC1.8 67.87,55.46 L24.P$2 53.57,55.46 C46.1
N$3
  Top 0.61: IC1.1 C45.2
N$4
  Top 1.016: L24.P$1 58.85,44.68 R1.1 R4.1 R3.1 R2.1
N$5
  Top 0.61: IC3.3 124.46,52.07
  Top 1.016: 124.46,52.07 C37.2
N$6
  Top 1.016: 119.38,53.77 L19.P$2 | 119.38,53.77 IC3.1 | C38.1 119.38,53.77
N$7
  Top 0.813: L19.P$1 R5.1
  Top 1.016: L19.P$1 | L19.P$1
N$8
  Top 0.61: 101.61,53.77 101.73,53.77 IC5.3
  Top 1.016: C41.2 101.61,53.77
N$9
  Top 0.61: IC4.3 74.93,16.09 74.93,16.08
  Top 1.016: C11.2 74.93,16.08
N$10
  Top 0.813: IC4.1 77.2,14.35
  Top 1.016: 77.2,14.35 L8.P$2 C13.1
N$11
  Top 0.813: L8.P$1 80.01,9.23 R6.1
N$12
  Top 1.016: C8.2 L7.1
N$13
  Top 1.016: C50.1 X2.1
N$14
  Top 0.813: C43.1 91.03,55.47
  Top 1.016: 91.03,55.47 96.52,55.47 | 96.52,55.47 IC5.1 | L21.P$2 95.89,56.11 96.52,55.47
N$15
  Top 1.016: 167.64,16.51 167.64,20.32 | 167.64,20.32 L14.P$1 | 167.64,16.51 C26.1 | 167.64,20.32 C27.1 | U$9.C_OUT 167.64,16.51
N$16
  Top 1.016: C1.1 X1.1 2.54,17.78
N$17
  Top 0.61: C21.1 L12.P$2 IC7.8
N$18
  Top 1.016: C27.2 167.64,27.94 | 167.64,27.94 167.64,32.38 | 167.64,32.38 C29.1 | 167.64,32.38 L15.P$1 | 167.64,27.94 C28.1
N$19
  Top 0.61: C20.2 IC7.1
N$20
  Top 1.016: R16.1 R15.1 R14.1 R13.1 L12.P$1
N$21
  Top 0.813: R7.1 L21.P$1
N$22
  Top 1.016: L7.2 69.22,16.08 | 69.22,16.08 C11.1 | 69.22,16.08 C10.1
N$23
  Top 1.016: C29.2 167.64,41.27 | 167.64,41.27 167.64,45.72 | 167.64,45.72 C31.1 | 167.64,45.72 L16.P$1 | 167.64,41.27 C30.1
N$24
  Top 1.016: L17.P$1 160.02,52.22 | 163.83,52.16 159.44,52.16 L17.P$1 | 163.83,52.16 U$10.C_OUT | 163.83,52.16 C32.1 | L17.P$1 155.31,52.22 C33.1
N$25
  Top 1.016: C35.1 145.41,52.07 | 145.41,52.07 150.5,52.07 | 150.5,52.07 C33.2 | 145.41,52.07 L18.P$1 | 150.5,52.07 C34.1
N$26
  Top 1.016: U$9.C_IN C25.2
N$27
  Top 1.016: L11.2 127,14.35 | 127,14.35 C20.1 | 127,14.35 C19.1
N$28
  Top 1.016: C13.2 L9.1
N$29
  Top 1.016: C21.2 L13.1
N$30
  Top 1.016: C36.1 135.89,52.07 | 135.89,52.07 C35.2 | 135.89,52.07 L22.1
N$31
  Top 1.016: L20.1 C38.2
N$32
  Top 1.016: C41.1 107.31,53.77 | 107.31,53.77 L20.2 | 107.31,53.77 C40.1
N$33
  Top 1.016: IC2.1 58.42,16.08 | 58.42,16.08 C8.1 | C8.1 | L6.P$2 58.42,16 58.42,16.08
N$34
  Top 1.016: L23.1 C43.2
N$35
  Top 1.016: 82.55,55.47 L23.2 | 82.55,55.47 C44.1 | C45.1 82.55,55.47
N$36
  Top 1.016: L25.1 C46.2
N$37
  Top 1.016: U$10.C_IN 167.64,50.78 C31.2
N$38
  Top 1.016: U$11.C_IN 38.71,58.81 C50.2
N$40
  Top 0.61: C15.2 IC6.1
N$41
  Top 0.813: R8.1 L6.P$1
  Top 1.016: L6.P$1
N$43
  Top 0.61: IC6.8 L10.P$2 C16.1
N$67
  Top 0.61: 52.07,17.78 IC2.3
  Top 1.016: C7.2 52.07,17.78
N$69
  Top 1.016: L10.P$1 R9.1 R10.1 R11.1 R12.1
N$71
  Top 1.016: 30.65,17.5 30.65,17.78 | 30.65,17.78 L3.2 | 30.65,17.78 C4.1
PRE_FILTER_IN
  Top 1.016: L1.2 15.24,17.78 | 15.24,17.78 18.41,17.78 | 18.41,17.78 21.59,17.78 | 21.59,17.78 26.75,17.78 L3.1 | 15.24,17.78 C2.1 | 21.59,17.78 C3.1 | 18.41,17.78 L2.1
RF_GAIN_OUT
  Top 1.016: 46.74,55.41 L25.2 46.7,55.4 43.81,55.4 C49.1 | C49.1 43.81,55.38 | U$11.C_OUT 43.73,55.38 C49.1
RF_IN
  Top 1.016: C1.2 L1.1

### Text on the board
Silkscreen: +5V | GND | +5V | GND | OUTPUT | +9V | GND | +9V | GND | GND | +9V | INPUT | GND | +5V | RF FRONT END BOARD | GND | +5V